# Altium project ADAPTONE_CARTE_DE_SON.PrjPCB (part 1 of 3)
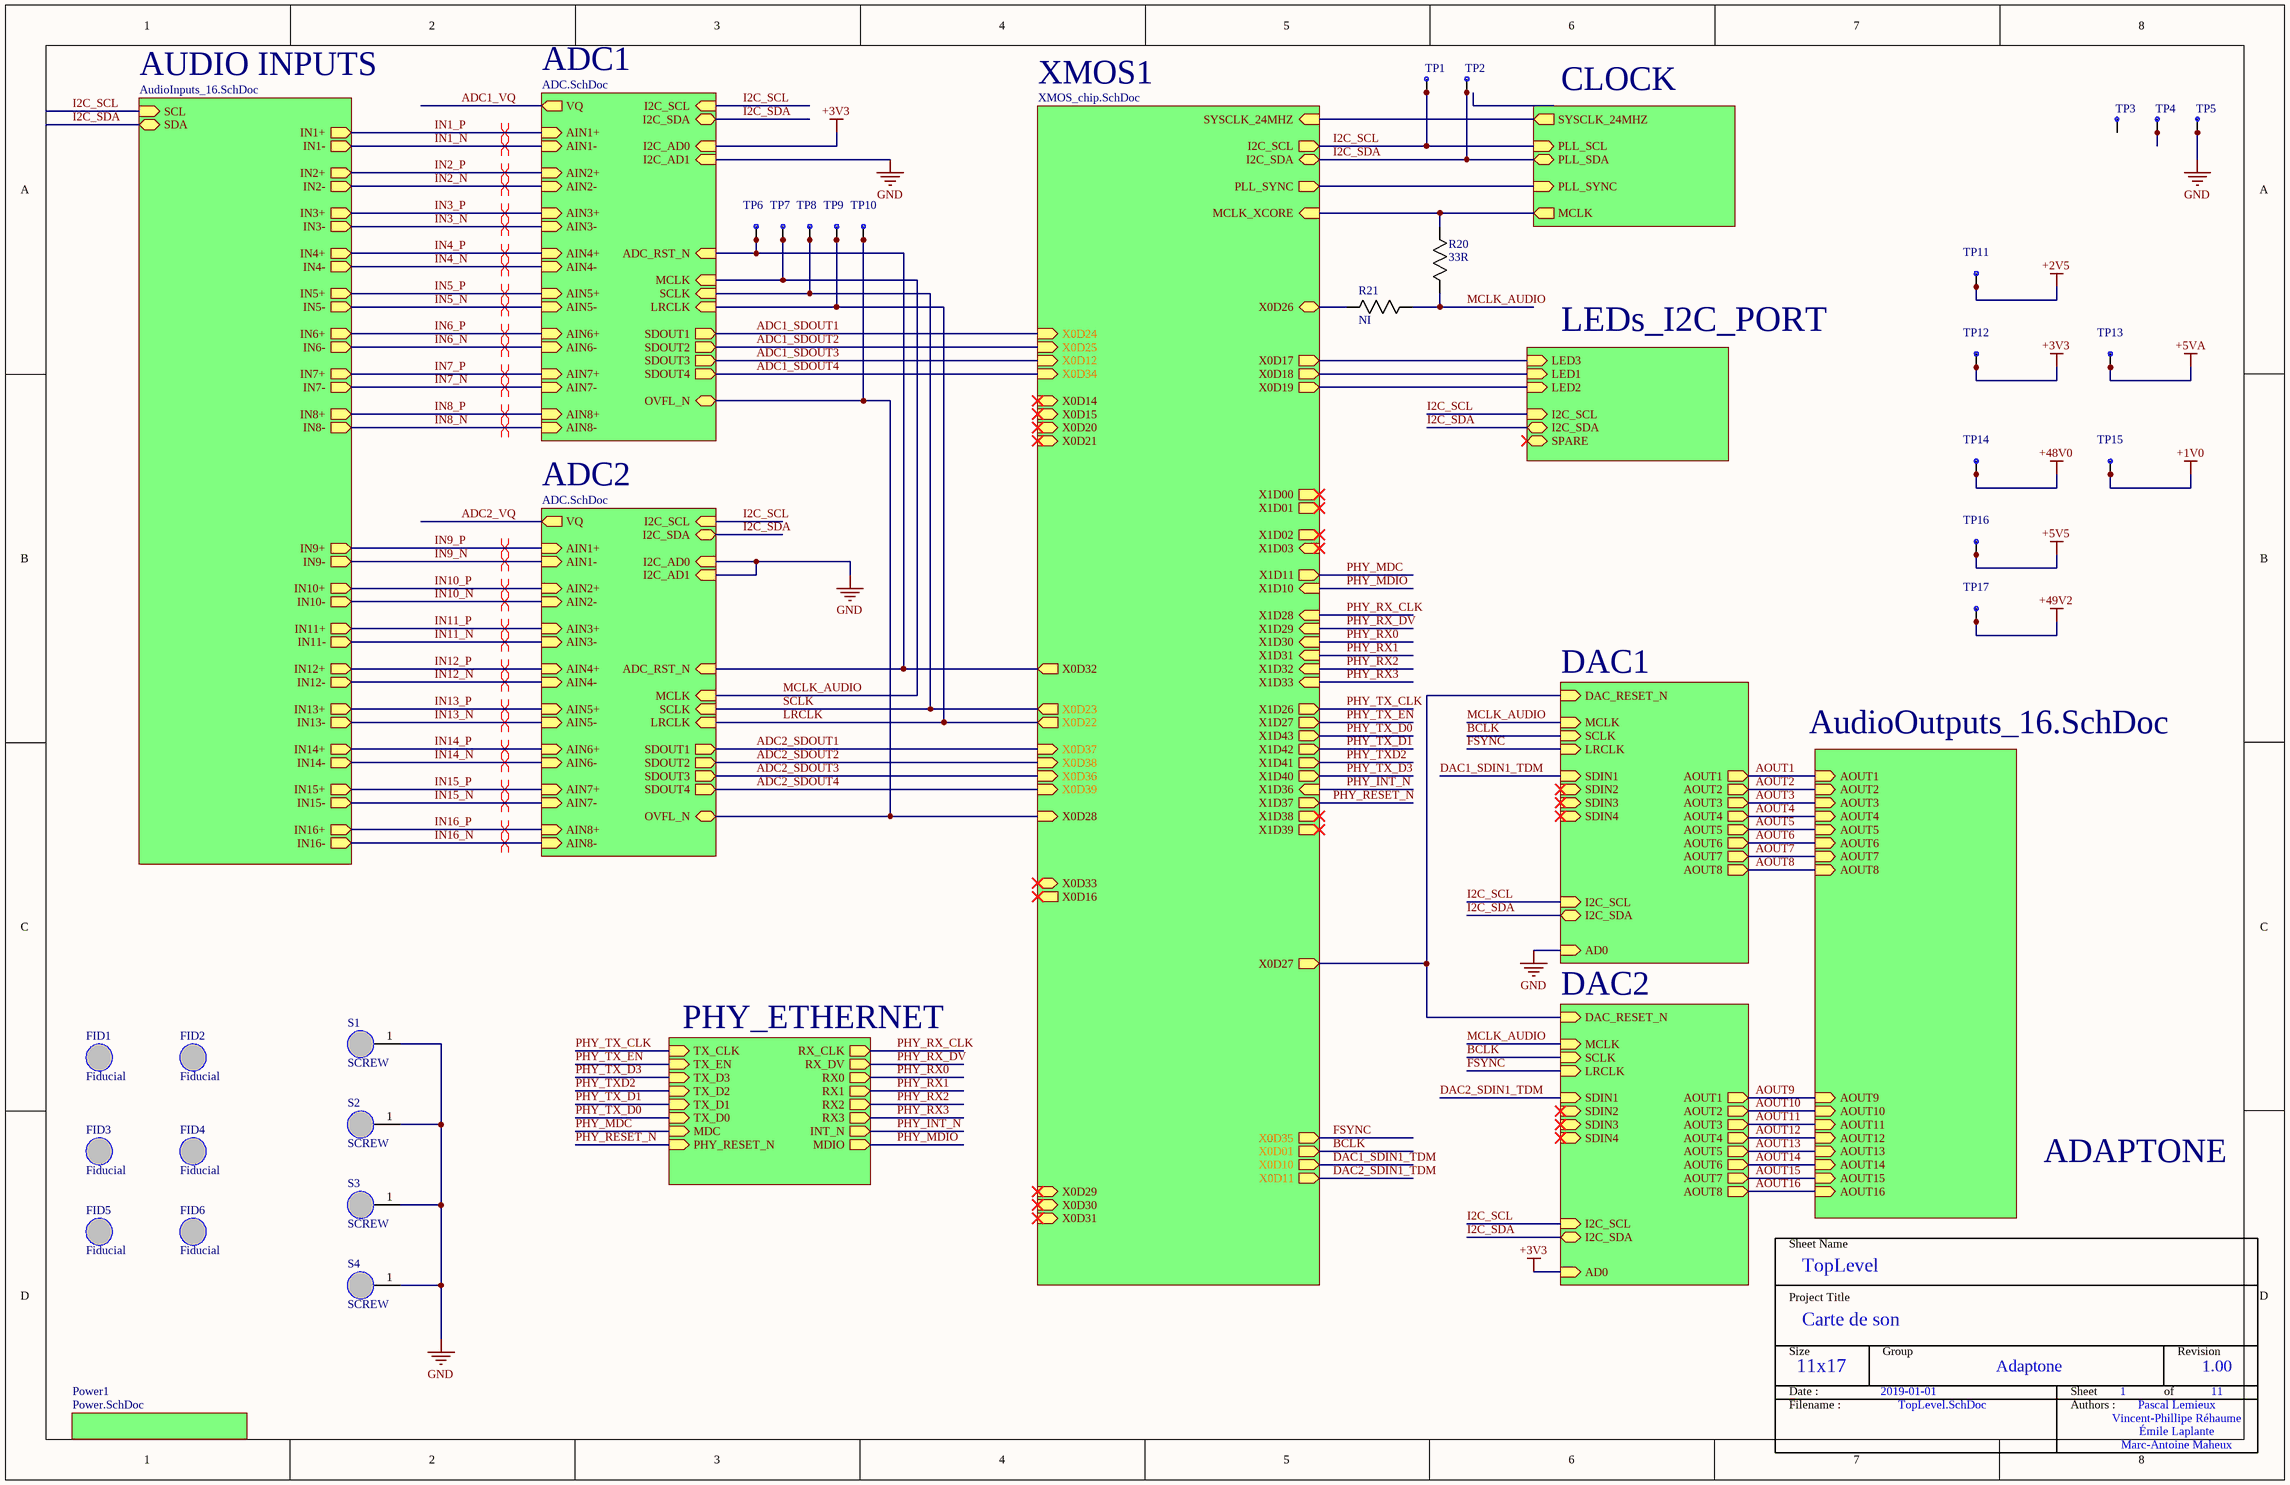
[diagram p0: TopLevel.SchDoc]
Project_Date: 2019-01-01; Project_Designer1: Pascal Lemieux; Project_Designer2: Vincent-Phillipe Réhaume; Project_Designer3: Émile Laplante; Project_Designer4: Marc-Antoine Maheux; Project_Group: Adaptone; Project_Name: Carte de son; Project_Revision: 1.00
15 sheets, 1792 parts. Net scope: hierarchical (ports join the sheet entries above them; power ports are global).
Board file: ADAPTONE_PCB.PcbDoc
Sheets:
  TopLevel.SchDoc
    Power1 = Power.SchDoc
    XMOS1 = XMOS_chip.SchDoc
      XMOS_power = XMOS_power.SchDoc
    CLOCK = Clock.SchDoc
    ADC1 = ADC.SchDoc
    DAC2 = DAC.SchDoc
    AUDIO INPUTS = AudioInputs_16.SchDoc
      U_InputsConnectors = InputsConnectors.SchDoc
        U_InputAmplifier = InputAmplifier.SchDoc
        U_InputAmplifier = InputAmplifier.SchDoc
      U_InputsConnectors = InputsConnectors.SchDoc
        U_InputAmplifier = InputAmplifier.SchDoc
        U_InputAmplifier = InputAmplifier.SchDoc
      U_InputsConnectors = InputsConnectors.SchDoc
        U_InputAmplifier = InputAmplifier.SchDoc
        U_InputAmplifier = InputAmplifier.SchDoc
      U_InputsConnectors = InputsConnectors.SchDoc
        U_InputAmplifier = InputAmplifier.SchDoc
        U_InputAmplifier = InputAmplifier.SchDoc
      U_InputsConnectors = InputsConnectors.SchDoc
        U_InputAmplifier = InputAmplifier.SchDoc
        U_InputAmplifier = InputAmplifier.SchDoc
      U_InputsConnectors = InputsConnectors.SchDoc
        U_InputAmplifier = InputAmplifier.SchDoc
        U_InputAmplifier = InputAmplifier.SchDoc
      U_InputsConnectors = InputsConnectors.SchDoc
        U_InputAmplifier = InputAmplifier.SchDoc
        U_InputAmplifier = InputAmplifier.SchDoc
      U_InputsConnectors = InputsConnectors.SchDoc
        U_InputAmplifier = InputAmplifier.SchDoc
        U_InputAmplifier = InputAmplifier.SchDoc
    DAC1 = DAC.SchDoc
    ADC2 = ADC.SchDoc
    U_AudioOutputs_16 = AudioOutputs_16.SchDoc
      U_OutputConnectors = OutputConnectors.SchDoc
      U_OutputConnectors = OutputConnectors.SchDoc
      U_OutputConnectors = OutputConnectors.SchDoc
      U_OutputConnectors = OutputConnectors.SchDoc
      U_OutputConnectors = OutputConnectors.SchDoc
      U_OutputConnectors = OutputConnectors.SchDoc
      U_OutputConnectors = OutputConnectors.SchDoc
      U_OutputConnectors = OutputConnectors.SchDoc
      U_StereoHeadphoneDriver = StereoHeadphoneDriver.SchDoc
    PHY_ETHERNET = PHY_ETHERNET.SchDoc
    LEDs_I2C_PORT = U_LEDs_I2C_PORT.SchDoc

## Sheet TopLevel.SchDoc
size Tabloid; DocumentNumber: 1; Revision: 1; SheetNumber: 1; SheetTotal: 11; SheetName: Top level; Size: 11x17; Sheet_Name: TopLevel

### Parts
FID1  Fiducial  [FIDUCIAL]
FID2  Fiducial  [FIDUCIAL]
FID3  Fiducial  [FIDUCIAL]
FID4  Fiducial  [FIDUCIAL]
FID5  Fiducial  [FIDUCIAL]
FID6  Fiducial  [FIDUCIAL]
R20  value 33R  [0603]  (hidden comment: Resistor)
R21  Resistor  [0603]  (value not drawn)
S1  SCREW  [SCREW_4_40]
S2  SCREW  [SCREW_4_40]
S3  SCREW  [SCREW_4_40]
S4  SCREW  [SCREW_4_40]
TP1  TESTPOINT  [0603]  (value not drawn)
TP2  TESTPOINT  [0603]  (value not drawn)
TP3  TESTPOINT  [0603]  (value not drawn)
TP4  TESTPOINT  [0603]  (value not drawn)
TP5  TESTPOINT  [0603]  (value not drawn)
TP6  TESTPOINT  [0603]  (value not drawn)
TP7  TESTPOINT  [0603]  (value not drawn)
TP8  TESTPOINT  [0603]  (value not drawn)
TP9  TESTPOINT  [0603]  (value not drawn)
TP10  TESTPOINT  [0603]  (value not drawn)
TP11  TESTPOINT  [0603]  (value not drawn)
TP12  TESTPOINT  [0603]  (value not drawn)
TP13  TESTPOINT  [0603]  (value not drawn)
TP14  TESTPOINT  [0603]  (value not drawn)
TP15  TESTPOINT  [0603]  (value not drawn)
TP16  TESTPOINT  [0603]  (value not drawn)
TP17  TESTPOINT  [0603]  (value not drawn)

### Sub-sheets
ADC1 = ADC.SchDoc: I2C_SCL (in), I2C_SDA (bidir), I2C_AD1 (in), I2C_AD0 (in), SDOUT1 (out), SDOUT2 (out), SDOUT3 (out), SDOUT4 (out), LRCLK (in), SCLK (in), MCLK (in), ADC_RST_N (in), OVFL_N (bidir), AIN1+ (in), AIN1- (in), AIN2+ (in), AIN2- (in), AIN3+ (in), AIN3- (in), AIN4+ (in), AIN4- (in), AIN5+ (in), AIN5- (in), AIN6+ (in), AIN6- (in), AIN7+ (in), AIN7- (in), AIN8+ (in), AIN8- (in), VQ (out)
ADC2 = ADC.SchDoc: I2C_SCL (in), I2C_SDA (bidir), I2C_AD1 (in), I2C_AD0 (in), SDOUT1 (out), SDOUT2 (out), SDOUT3 (out), SDOUT4 (out), LRCLK (in), SCLK (in), MCLK (in), ADC_RST_N (in), OVFL_N (bidir), AIN1+ (in), AIN1- (in), AIN2+ (in), AIN2- (in), AIN3+ (in), AIN3- (in), AIN4+ (in), AIN4- (in), AIN5+ (in), AIN5- (in), AIN6+ (in), AIN6- (in), AIN7+ (in), AIN7- (in), AIN8+ (in), AIN8- (in), VQ (out)
AUDIO INPUTS = AudioInputs_16.SchDoc: IN1+ (out), IN1- (out), IN2+ (out), IN2- (out), IN3+ (out), IN3- (out), IN4+ (out), IN4- (out), IN5+ (out), IN5- (out), IN6+ (out), IN6- (out), IN7+ (out), IN7- (out), IN8+ (out), IN8- (out), SCL (in), SDA (bidir), IN9+ (out), IN9- (out), IN10+ (out), IN10- (out), IN11+ (out), IN11- (out), IN12+ (out), IN12- (out), IN13+ (out), IN13- (out), IN14+ (out), IN14- (out), IN15+ (out), IN15- (out), IN16+ (out), IN16- (out)
CLOCK = Clock.SchDoc: SYSCLK_24MHZ (out), PLL_SYNC (in), PLL_SCL (in), PLL_SDA (bidir), MCLK (out)
DAC1 = DAC.SchDoc: LRCLK (in), SCLK (in), MCLK (in), SDIN1 (in), SDIN2 (in), SDIN3 (in), SDIN4 (in), DAC_RESET_N (in), I2C_SCL (in), I2C_SDA (bidir), AOUT1 (out), AOUT2 (out), AOUT3 (out), AOUT4 (out), AOUT5 (out), AOUT6 (out), AOUT7 (out), AOUT8 (out), AD0 (in)
DAC2 = DAC.SchDoc: LRCLK (in), SCLK (in), MCLK (in), SDIN1 (in), SDIN2 (in), SDIN3 (in), SDIN4 (in), DAC_RESET_N (in), I2C_SCL (in), I2C_SDA (bidir), AOUT1 (out), AOUT2 (out), AOUT3 (out), AOUT4 (out), AOUT5 (out), AOUT6 (out), AOUT7 (out), AOUT8 (out), AD0 (in)
LEDs_I2C_PORT = U_LEDs_I2C_PORT.SchDoc: LED3 (in), LED1 (in), LED2 (in), SPARE (bidir), I2C_SDA (bidir), I2C_SCL (in)
PHY_ETHERNET = PHY_ETHERNET.SchDoc: TX_CLK (in), TX_EN (in), RX_CLK (out), RX_DV (out), RX0 (out), RX1 (out), RX2 (out), RX3 (out), TX_D3 (in), TX_D2 (in), TX_D1 (in), TX_D0 (in), INT_N (out), MDIO (out), MDC (in), PHY_RESET_N (in)
Power1 = Power.SchDoc: no entries
U_AudioOutputs_16 = AudioOutputs_16.SchDoc: AOUT1 (in), AOUT2 (in), AOUT3 (in), AOUT4 (in), AOUT5 (in), AOUT6 (in), AOUT7 (in), AOUT8 (in), AOUT9 (in), AOUT10 (in), AOUT11 (in), AOUT12 (in), AOUT13 (in), AOUT14 (in), AOUT15 (in), AOUT16 (in)
XMOS1 = XMOS_chip.SchDoc: SYSCLK_24MHZ (in), MCLK_XCORE (in), I2C_SCL (out), I2C_SDA (bidir), PLL_SYNC (out), X0D14 (in), X0D15 (in), X0D16 (out), X0D17 (out), X0D18 (out), X0D19 (out), X0D20 (in), X0D21 (in), X0D22 (out), X0D23 (out), X0D24 (in), X0D25 (in), X0D27 (out), X0D32 (out), X0D34 (in), X0D35 (out), X0D36 (in), X0D37 (in), X0D38 (in), X0D39 (in), X0D29 (in), X0D28 (in), X0D31 (in), X0D30 (in), X0D33 (bidir), X0D26 (bidir), X1D26 (out), X1D27 (out), X1D28 (in), X1D29 (in), X1D30 (in), X1D31 (in), X1D32 (in), X1D33 (in), X1D43 (out), X1D42 (out), X1D41 (out), X1D40 (out), X1D10 (in), X1D11 (out), X1D03 (in), X1D02 (out), X1D01 (out), X1D00 (out), X1D37 (out), X1D36 (in), X1D39 (out), X1D38 (out), X0D12 (in), X0D11 (out), X0D01 (out), X0D10 (out)

### Nets
+1V0: TP15.1 TP15.2
+2V5: TP11.1 TP11.2
+3V3: TP12.1 TP12.2 ; sheet ADC1/I2C_AD0, sheet DAC2/AD0
+5V5: TP16.1 TP16.2
+5VA: TP13.1 TP13.2
+48V0: TP14.1 TP14.2
+49V2: TP17.1 TP17.2
GND: S1.1 S2.1 S3.1 S4.1 TP5.1 TP5.2 ; sheet ADC1/I2C_AD1, sheet DAC1/AD0, sheet ADC2/I2C_AD1, sheet ADC2/I2C_AD0
ADC1_SDOUT1: sheet XMOS1/X0D24, sheet ADC1/SDOUT1
ADC1_SDOUT2: sheet XMOS1/X0D25, sheet ADC1/SDOUT2
ADC1_SDOUT3: sheet XMOS1/X0D12, sheet ADC1/SDOUT3
ADC1_SDOUT4: sheet XMOS1/X0D34, sheet ADC1/SDOUT4
ADC2_SDOUT1: sheet XMOS1/X0D37, sheet ADC2/SDOUT1
ADC2_SDOUT2: sheet XMOS1/X0D38, sheet ADC2/SDOUT2
ADC2_SDOUT3: sheet XMOS1/X0D36, sheet ADC2/SDOUT3
ADC2_SDOUT4: sheet XMOS1/X0D39, sheet ADC2/SDOUT4
AOUT1: sheet DAC1/AOUT1, sheet U_AudioOutputs_16/AOUT1
AOUT2: sheet DAC1/AOUT2, sheet U_AudioOutputs_16/AOUT2
AOUT3: sheet DAC1/AOUT3, sheet U_AudioOutputs_16/AOUT3
AOUT4: sheet DAC1/AOUT4, sheet U_AudioOutputs_16/AOUT4
AOUT5: sheet DAC1/AOUT5, sheet U_AudioOutputs_16/AOUT5
AOUT6: sheet DAC1/AOUT6, sheet U_AudioOutputs_16/AOUT6
AOUT7: sheet DAC1/AOUT7, sheet U_AudioOutputs_16/AOUT7
AOUT8: sheet DAC1/AOUT8, sheet U_AudioOutputs_16/AOUT8
AOUT9: sheet DAC2/AOUT1, sheet U_AudioOutputs_16/AOUT9
AOUT10: sheet DAC2/AOUT2, sheet U_AudioOutputs_16/AOUT10
AOUT11: sheet DAC2/AOUT3, sheet U_AudioOutputs_16/AOUT11
AOUT12: sheet DAC2/AOUT4, sheet U_AudioOutputs_16/AOUT12
AOUT13: sheet DAC2/AOUT5, sheet U_AudioOutputs_16/AOUT13
AOUT14: sheet DAC2/AOUT6, sheet U_AudioOutputs_16/AOUT14
AOUT15: sheet DAC2/AOUT7, sheet U_AudioOutputs_16/AOUT15
AOUT16: sheet DAC2/AOUT8, sheet U_AudioOutputs_16/AOUT16
BCLK: sheet XMOS1/X0D01, sheet DAC2/SCLK, sheet DAC1/SCLK
DAC1_SDIN1_TDM: sheet XMOS1/X0D10, sheet DAC1/SDIN1
DAC2_SDIN1_TDM: sheet XMOS1/X0D11, sheet DAC2/SDIN1
FSYNC: sheet XMOS1/X0D35, sheet DAC2/LRCLK, sheet DAC1/LRCLK
I2C_SCL: TP1.1 TP1.2 ; sheet XMOS1/I2C_SCL, sheet CLOCK/PLL_SCL, sheet ADC1/I2C_SCL, sheet DAC2/I2C_SCL, sheet AUDIO INPUTS/SCL, sheet DAC1/I2C_SCL, sheet ADC2/I2C_SCL, sheet LEDs_I2C_PORT/I2C_SCL
I2C_SDA: TP2.1 TP2.2 ; sheet XMOS1/I2C_SDA, sheet CLOCK/PLL_SDA, sheet ADC1/I2C_SDA, sheet DAC2/I2C_SDA, sheet AUDIO INPUTS/SDA, sheet DAC1/I2C_SDA, sheet ADC2/I2C_SDA, sheet LEDs_I2C_PORT/I2C_SDA
IN1_N: sheet ADC1/AIN1-, sheet AUDIO INPUTS/IN1-
IN1_P: sheet ADC1/AIN1+, sheet AUDIO INPUTS/IN1+
IN2_N: sheet ADC1/AIN2-, sheet AUDIO INPUTS/IN2-
IN2_P: sheet ADC1/AIN2+, sheet AUDIO INPUTS/IN2+
IN3_N: sheet ADC1/AIN3-, sheet AUDIO INPUTS/IN3-
IN3_P: sheet ADC1/AIN3+, sheet AUDIO INPUTS/IN3+
IN4_N: sheet ADC1/AIN4-, sheet AUDIO INPUTS/IN4-
IN4_P: sheet ADC1/AIN4+, sheet AUDIO INPUTS/IN4+
IN5_N: sheet ADC1/AIN5-, sheet AUDIO INPUTS/IN5-
IN5_P: sheet ADC1/AIN5+, sheet AUDIO INPUTS/IN5+
IN6_N: sheet ADC1/AIN6-, sheet AUDIO INPUTS/IN6-
IN6_P: sheet ADC1/AIN6+, sheet AUDIO INPUTS/IN6+
IN7_N: sheet ADC1/AIN7-, sheet AUDIO INPUTS/IN7-
IN7_P: sheet ADC1/AIN7+, sheet AUDIO INPUTS/IN7+
IN8_N: sheet ADC1/AIN8-, sheet AUDIO INPUTS/IN8-
IN8_P: sheet ADC1/AIN8+, sheet AUDIO INPUTS/IN8+
IN9_N: sheet AUDIO INPUTS/IN9-, sheet ADC2/AIN1-
IN9_P: sheet AUDIO INPUTS/IN9+, sheet ADC2/AIN1+
IN10_N: sheet AUDIO INPUTS/IN10-, sheet ADC2/AIN2-
IN10_P: sheet AUDIO INPUTS/IN10+, sheet ADC2/AIN2+
IN11_N: sheet AUDIO INPUTS/IN11-, sheet ADC2/AIN3-
IN11_P: sheet AUDIO INPUTS/IN11+, sheet ADC2/AIN3+
IN12_N: sheet AUDIO INPUTS/IN12-, sheet ADC2/AIN4-
IN12_P: sheet AUDIO INPUTS/IN12+, sheet ADC2/AIN4+
IN13_N: sheet AUDIO INPUTS/IN13-, sheet ADC2/AIN5-
IN13_P: sheet AUDIO INPUTS/IN13+, sheet ADC2/AIN5+
IN14_N: sheet AUDIO INPUTS/IN14-, sheet ADC2/AIN6-
IN14_P: sheet AUDIO INPUTS/IN14+, sheet ADC2/AIN6+
IN15_N: sheet AUDIO INPUTS/IN15-, sheet ADC2/AIN7-
IN15_P: sheet AUDIO INPUTS/IN15+, sheet ADC2/AIN7+
IN16_N: sheet AUDIO INPUTS/IN16-, sheet ADC2/AIN8-
IN16_P: sheet AUDIO INPUTS/IN16+, sheet ADC2/AIN8+
LRCLK: TP9.1 TP9.2 ; sheet XMOS1/X0D22, sheet ADC1/LRCLK, sheet ADC2/LRCLK
MCLK_AUDIO: R20.1 R21.2 TP7.1 TP7.2 ; sheet ADC1/MCLK, sheet DAC2/MCLK, sheet DAC1/MCLK, sheet ADC2/MCLK
MCLK_XCORE: R20.2 ; sheet XMOS1/MCLK_XCORE, sheet CLOCK/MCLK
PHY_INT_N: sheet XMOS1/X1D36, sheet PHY_ETHERNET/INT_N  [project net INT_N]
PHY_MDC: sheet XMOS1/X1D11, sheet PHY_ETHERNET/MDC
PHY_MDIO: sheet XMOS1/X1D10, sheet PHY_ETHERNET/MDIO
PHY_RESET_N: sheet XMOS1/X1D37, sheet PHY_ETHERNET/PHY_RESET_N
PHY_RX0: sheet XMOS1/X1D30, sheet PHY_ETHERNET/RX0
PHY_RX1: sheet XMOS1/X1D31, sheet PHY_ETHERNET/RX1
PHY_RX2: sheet XMOS1/X1D32, sheet PHY_ETHERNET/RX2
PHY_RX3: sheet XMOS1/X1D33, sheet PHY_ETHERNET/RX3
PHY_RX_CLK: sheet XMOS1/X1D28, sheet PHY_ETHERNET/RX_CLK
PHY_RX_DV: sheet XMOS1/X1D29, sheet PHY_ETHERNET/RX_DV
PHY_TX_CLK: sheet XMOS1/X1D26, sheet PHY_ETHERNET/TX_CLK
PHY_TX_D0: sheet XMOS1/X1D43, sheet PHY_ETHERNET/TX_D0
PHY_TX_D1: sheet XMOS1/X1D42, sheet PHY_ETHERNET/TX_D1
PHY_TX_D3: sheet XMOS1/X1D40, sheet PHY_ETHERNET/TX_D3
PHY_TX_EN: sheet XMOS1/X1D27, sheet PHY_ETHERNET/TX_EN
PHY_TXD2: sheet XMOS1/X1D41, sheet PHY_ETHERNET/TX_D2
SCLK: TP8.1 TP8.2 ; sheet XMOS1/X0D23, sheet ADC1/SCLK, sheet ADC2/SCLK
NetR1_2: sheet XMOS1/SYSCLK_24MHZ, sheet CLOCK/SYSCLK_24MHZ
NetR21_1: R21.1 ; sheet XMOS1/X0D26
NetR31.1_2: TP10.1 TP10.2 ; sheet XMOS1/X0D28, sheet ADC1/OVFL_N, sheet ADC2/OVFL_N
NetR140_1: sheet XMOS1/X0D18, sheet LEDs_I2C_PORT/LED1
NetR141_1: sheet XMOS1/X0D19, sheet LEDs_I2C_PORT/LED2
NetR142_1: sheet XMOS1/X0D17, sheet LEDs_I2C_PORT/LED3
NetTP3_1: TP3.1 TP3.2
NetTP4_1: TP4.1 TP4.2
NetTP6_1: TP6.1 TP6.2 ; sheet XMOS1/X0D32, sheet ADC1/ADC_RST_N, sheet ADC2/ADC_RST_N
NetU1_5: sheet XMOS1/PLL_SYNC, sheet CLOCK/PLL_SYNC
NetU8_94: sheet XMOS1/X0D27, sheet DAC2/DAC_RESET_N, sheet DAC1/DAC_RESET_N

Not connected (* = marked no-connect by the designer): FID1 0; FID2 0; FID3 0; FID4 0; FID5 0; FID6 0

### Layout directives
differential pair: IN1_N, IN1_P, IN2_N, IN2_P, IN3_N, IN3_P, IN4_N, IN4_P, IN5_N, IN5_P, IN6_N, IN6_P, IN7_N, IN7_P, IN8_N, IN8_P, IN9_N, IN9_P, IN10_N, IN10_P, IN11_N, IN11_P, IN12_N, IN12_P, IN13_N, IN13_P, IN14_N, IN14_P, IN15_N, IN15_P, IN16_N, IN16_P

### Notes on the sheet
- ADAPTONE
- Sheet Name
- Project Title
- Size
- Group
- Revision
- Date :
- Filename :
- Sheet
- Authors :
- of

### Library data of the parts
R20 = Resistor: Mfg: Yageo; Mfg_PN: RC0603JR-0733RL; HelpURL: *; NI: *; Supplier1: Digikey; Supplier1_PN: 311-33GRCT-ND; Type: *; Rating: *; Tolerance: *
R21 = Resistor: Mfg: Yageo; Mfg_PN: RC0603JR-0733RL; Value: 33R; HelpURL: *; NI: NI; Supplier1: Digikey; Supplier1_PN: 311-33GRCT-ND; Type: *; Rating: *; Tolerance: *
S1-S4 = SCREW: Screw hole; HelpURL: *; Mfg: *; Mfg_PN: *; NI: NI; Rating: *; Supplier1: *; Supplier1_PN: *; Tolerance: *; Type: *; Value: *
TP1 TP2 TP6-TP17 = TESTPOINT: Test point; Mfg: TE; Mfg_PN: RCU-0C; HelpURL: *; NI: *; Rating: *; Supplier1: Digikey; Supplier1_PN: A106145CT-ND; Tolerance: *; Type: *; Value: *
TP3-TP5 = TESTPOINT: Test point; Mfg: Harwin; Mfg_PN: S1751-46; HelpURL: *; NI: *; Rating: *; Supplier1: Digikey; Supplier1_PN: 952-3024-ND; Tolerance: *; Type: *; Value: *
FID1-FID6 = Fiducial: HelpURL: *; Mfg: *; Mfg_PN: *; NI: NI; Rating: *; Supplier1: *; Supplier1_PN: *; Tolerance: *; Type: *; Value: *

## Sheet Power.SchDoc
size Tabloid; DocumentNumber: 2; SheetNumber: 2; SheetTotal: 11; SheetName: Main power supply; Size: 11x17; Sheet_Name: Power
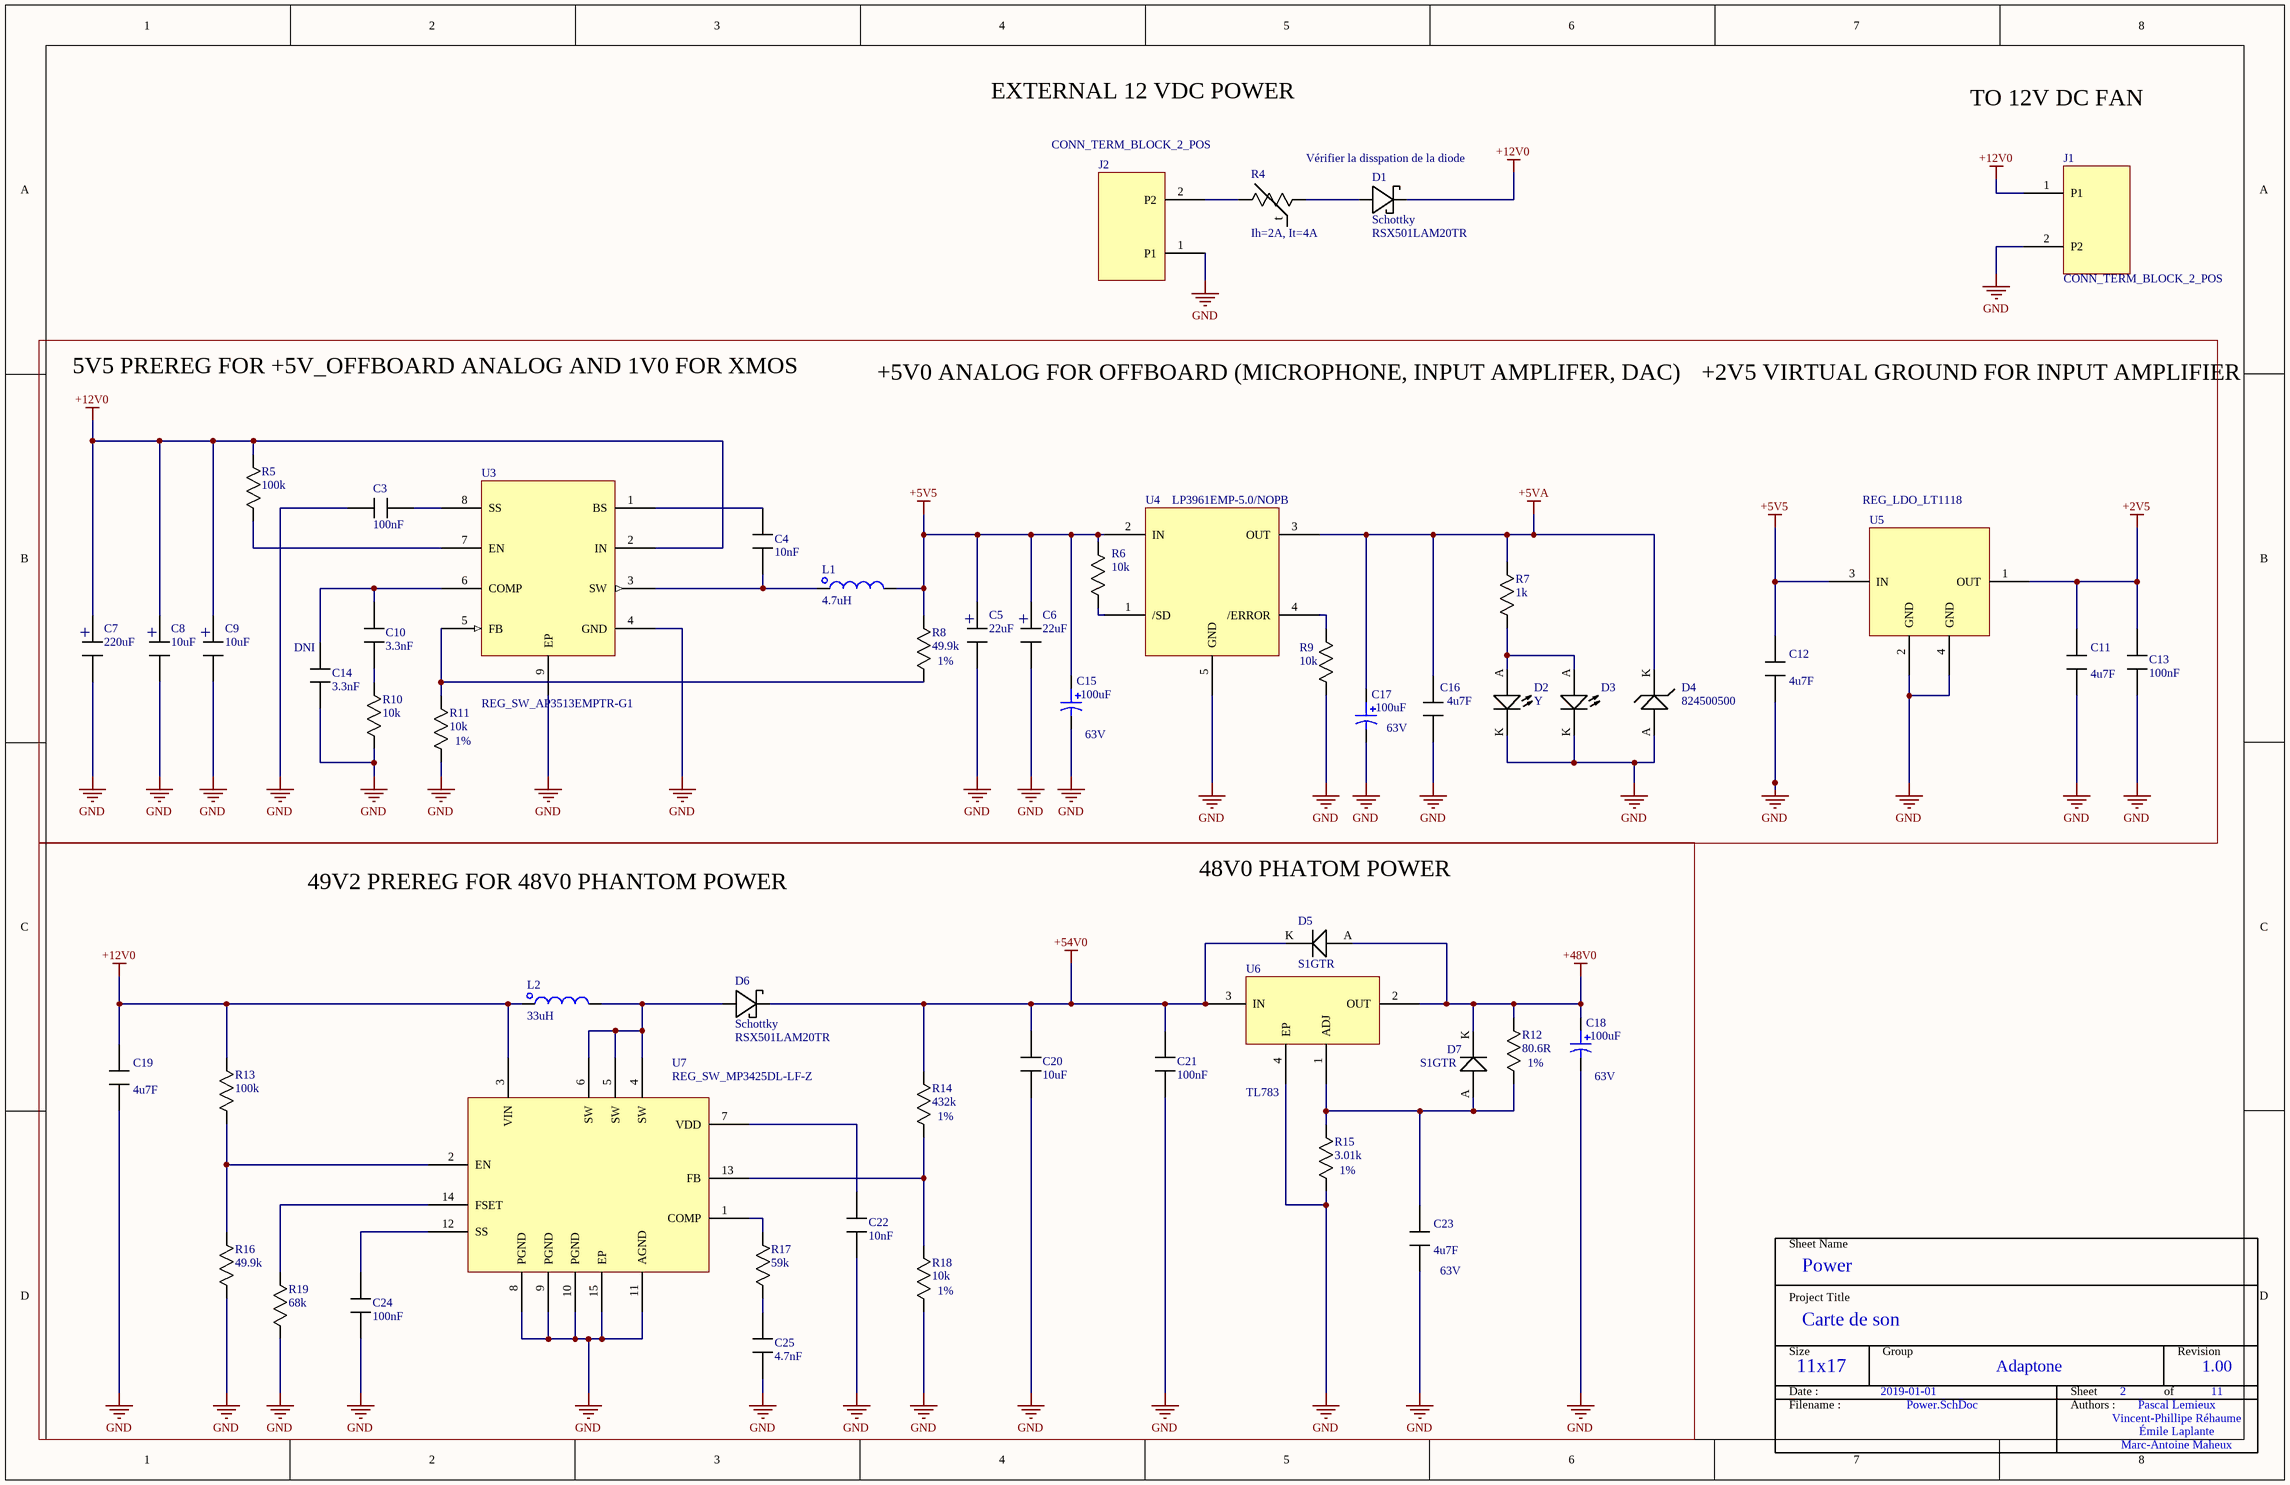
[diagram p1: Power.SchDoc]

### Parts
C3  value 100nF  [0603]  (hidden comment: Capacitor)
C4  value 10nF  [0603]  (hidden comment: Capacitor)
C5  value 22uF  [CAP_RAD_SMD_DIA157]  (hidden comment: Capacitor_Polarized)
C6  value 22uF  [CAP_RAD_SMD_DIA157]  (hidden comment: Capacitor_Polarized)
C7  value 220uF  [CAP_RAD_SMD_DIA315]  (hidden comment: Capacitor_Polarized)
C8  value 10uF  [CAP_RAD_SMD_DIA157]  (hidden comment: Capacitor_Polarized)
C9  value 10uF  [CAP_RAD_SMD_DIA157]  (hidden comment: Capacitor_Polarized)
C10  value 3.3nF  [0603]  (hidden comment: Capacitor)
C11  value 4u7F  [0805]  (hidden comment: Capacitor)
C12  value 4u7F  [0805]  (hidden comment: Capacitor)
C13  value 100nF  [0603]  (hidden comment: Capacitor)
C14  value 3.3nF  note: DNI  [0603]  (hidden comment: Capacitor)
C15  value 100uF  Voltage: 63V  [CAP_ALU_1010_vishay]  (hidden comment: MAL215099101E3)
C16  value 4u7F  [0603]  (hidden comment: Capacitor)
C17  value 100uF  Voltage: 63V  [CAP_ALU_1010_vishay]  (hidden comment: MAL215099101E3)
C18  value 100uF  Voltage: 63V  [CAP_ALU_1010_vishay]  (hidden comment: MAL215099101E3)
C19  value 4u7F  [0805]  (hidden comment: Capacitor)
C20  value 10uF  [CAP_1210]  (hidden comment: Capacitor)
C21  value 100nF  [0603]  (hidden comment: Capacitor)
C22  value 10nF  [0603]  (hidden comment: Capacitor)
C23  value 4u7F  voltage: 63V  [0603]  (hidden comment: Capacitor)
C24  value 100nF  [0603]  (hidden comment: Capacitor)
C25  value 4.7nF  [0603]  (hidden comment: Capacitor)
D1  Schottky  Mfg Part Number: RSX501LAM20TR  [SOD-123F]
D2  Type: Y  [0805_LED]  (hidden comment: Diode_LED)
D3  Diode_LED  [0805_LED]  (value not drawn)
D4  Mfg_PN: 824500500  [DIODE_DO-214AC/SMA]  (hidden comment: Diode_zener)
D5  Mfg_PN: S1GTR  [DIODE_SMA]  (hidden comment: Diode)
D6  Schottky  Mfg Part Number: RSX501LAM20TR  [SOD-123F]
D7  Mfg_PN: S1GTR  [DIODE_SMA]  (hidden comment: Diode)
J1  CONN_TERM_BLOCK_2_POS  [TERM BLOCK]
J2  CONN_TERM_BLOCK_2_POS  [TERM BLOCK]
L1  value 4.7uH  [IND_252012CDMC/DS]  (hidden comment: Inductor)
L2  value 33uH  [IND_252012CDMC/DS]  (hidden comment: Inductor)
R4  value Ih=2A, It=4A  [1206_PTC]  (hidden comment: Resistor_PTC)
R5  value 100k  [0603]  (hidden comment: Resistor)
R6  value 10k  [0603]  (hidden comment: Resistor)
R7  value 1k  [0603]  (hidden comment: Resistor)
R8  value 49.9k  Tolerance: 1%  [0603]  (hidden comment: Resistor)
R9  value 10k  [0603]  (hidden comment: Resistor)
R10  value 10k  [0603]  (hidden comment: Resistor)
R11  value 10k  Tolerance: 1%  [0603]  (hidden comment: Resistor)
R12  value 80.6R  Tolerance: 1%  [0603]  (hidden comment: Resistor)
R13  value 100k  [0603]  (hidden comment: Resistor)
R14  value 432k  Tolerance: 1%  [0603]  (hidden comment: Resistor)
R15  value 3.01k  Tolerance: 1%  [0603]  (hidden comment: Resistor)
R16  value 49.9k  [0603]  (hidden comment: Resistor)
R17  value 59k  [0603]  (hidden comment: Resistor)
R18  value 10k  Tolerance: 1%  [0603]  (hidden comment: Resistor)
R19  value 68k  [0603]  (hidden comment: Resistor)
U3  REG_SW_AP3513EMPTR-G1  [AP3513EMPTR-G1]
U4  LP3961EMP-5.0/NOPB  [TL783]
U5  REG_LDO_LT1118  [SOT-223-3]
U6  TL783  [TL783]
U7  REG_SW_MP3425DL-LF-Z  [14-VFDFN Exposed Pad]

### Nets
+2V5: C11.1 C13.2 U5.1(OUT)
+5V5: C5.+ C6.+ C12.1 C15.1 L1.2 R6.1 R8.1 U4.2(IN) U5.3(IN)
+5VA: C16.1 C17.1 D4.K R7.2 U4.3(OUT)
+12V0: C7.+ C8.+ C9.+ C19.1 D1.2(cathode) J1.1(P1) L2.1 R5.2 R13.2 U3.2(IN) U7.3(VIN)
+48V0: C18.1 D5.A D7.K R12.1 U6.2(OUT)
+54V0: C20.1 C21.2 D5.K D6.2(cathode) R14.1 U6.3(IN)
GND: C3.1 C5.- C6.- C7.- C8.- C9.- C11.2 C12.2 C13.1 C14.2 C15.2 C16.2 C17.2 C18.2 C19.2 C20.2 C21.1 C22.2 C23.2 C24.1 C25.2 D2.K D3.K D4.A J1.2(P2) J2.1(P1) R9.2 R10.2 R11.2 R15.2 R16.2 R18.2 R19.1 U3.4(GND) U3.9(EP) U4.5(GND) U5.2(GND) U5.4(GND) U6.4(EP) U7.8(PGND) U7.9(PGND) U7.10(PGND) U7.11(AGND) U7.15(EP)
NetC3_2: C3.2 U3.8(SS)
NetC4_1: C4.1 U3.1(BS)
NetC4_2: C4.2 L1.1 U3.3(SW)
NetC10_1: C10.1 C14.1 U3.6(COMP)
NetC10_2: C10.2 R10.1
NetC22_1: C22.1 U7.7(VDD)
NetC23_1: C23.1 D7.A R12.2 R15.1 U6.1(ADJ)
NetC24_2: C24.2 U7.12(SS)
NetC25_1: C25.1 R17.2
NetD1_1: D1.1(anode) R4.2
NetD2_A: D2.A D3.A R7.1
NetD6_1: D6.1(anode) L2.2 U7.4(SW) U7.5(SW) U7.6(SW)
NetJ2_2: J2.2(P2) R4.1
NetR5_1: R5.1 U3.7(EN)
NetR6_2: R6.2 U4.1(/SD)
NetR8_2: R8.2 R11.1 U3.5(FB)
NetR9_1: R9.1 U4.4(/ERROR)
NetR13_1: R13.1 R16.1 U7.2(EN)
NetR14_2: R14.2 R18.1 U7.13(FB)
NetR17_1: R17.1 U7.1(COMP)
NetR19_2: R19.2 U7.14(FSET)

### Notes on the sheet
- EXTERNAL 12 VDC POWER
- Vérifier la disspation de la diode
- TO 12V DC FAN
- 5V5 PREREG FOR +5V_OFFBOARD ANALOG AND 1V0 FOR XMOS
- +5V0 ANALOG FOR OFFBOARD (MICROPHONE, INPUT AMPLIFER, DAC)
- +2V5 VIRTUAL GROUND FOR INPUT AMPLIFIER
- 49V2 PREREG FOR 48V0 PHANTOM POWER
- 48V0 PHATOM POWER
- Sheet Name
- Project Title
- Size
- Group
- Revision
- Date :
- Filename :
- Sheet
- Authors :
- of
- (in symbol Resistor_PTC) t

### Library data of the parts
C3 C13 C24 = Capacitor: Mfg: Samsung; Mfg_PN: CL10F104ZO8NNNC; HelpURL: *; NI: NI; Supplier1: Digikey; Supplier1_PN: 1276-1258-1-ND; Tolerance: *; Type: *; Rating: *
C4 C22 = Capacitor: Mfg: Samsung; Mfg_PN: CL10B102KB8NNNC; HelpURL: https://www.digikey.ca/product-detail/en/samsung-electro-mechanics/CL10B102KB8NNNC/1276-1018-1-ND/3889104; NI: NI; Supplier1: Digikey; Supplier1_PN: 1276-1018-1-ND; Tolerance: *; Type: *; Rating: *
C5 = Capacitor_Polarized: Capacitor; Mfg: Panasonic; Mfg_PN: Part Number EEE-FT1V220AR; HelpURL: *; NI: *; Supplier1: Digikey; Supplier1_PN: PCE5012CT-ND; Tolerance: *; Type: *; Rating: *
C6 = Capacitor_Polarized: Capacitor; Mfg: Panasonic; Mfg_PN: EEE-FT1V220AR; HelpURL: *; NI: *; Supplier1: Digikey; Supplier1_PN: PCE5012CT-ND; Tolerance: *; Type: *; Rating: *
C7 = Capacitor_Polarized_1: Capacitor; Mfg: Nichicon; Mfg_PN: UWT1E221MNL1GS; HelpURL: *; NI: *; Supplier1: Digikey; Supplier1_PN: 493-2192-1-ND; Tolerance: *; Type: *; Rating: *
C8 C9 = Capacitor_Polarized: Capacitor; Mfg: Nichicon; Mfg_PN: UWX1C100MCL1GB; HelpURL: *; NI: *; Supplier1: Digikey; Supplier1_PN: 493-2100-1-ND; Tolerance: *; Type: *; Rating: *
C10 C14 = Capacitor: Mfg: Samsung; Mfg_PN: CL10B332JB8NNNC; HelpURL: *; NI: NI; Supplier1: Digikey; Supplier1_PN: 1276-2030-1-ND; Tolerance: *; Type: *; Rating: *
C11 C12 C16 C19 = Capacitor: Mfg: Samsung; Mfg_PN: CL21A475KAQNNNG; HelpURL: *; NI: *; Supplier1: Digikey; Supplier1_PN: 1276-6462-1-ND; Tolerance: *; Type: *; Rating: *
C15 C17 C18 = CAP_ALU_MAL215099101E3: CAP - ALU 100uF 20% 50V - 1010; Mfg Part Number: UUX1J101MNL1GS; Mfg: Nichicon; CreatedBy: Jonathan Bouchard; Temperature: -55°C to 125°C; Power: *; Supplier 1: Digikey; Supplier Part Number 1: 4399PHDKR-ND; Package: 1010; Precision: 20%; Supplier Part Number: *; Supplier Part Number: 493-7453-1-ND
C20 = Capacitor: Mfg: Samsung; Mfg_PN: CL32B106KMVNNWE; HelpURL: https://www.digikey.ca/product-detail/en/samsung-electro-mechanics/CL32B106KMVNNWE/1276-7053-1-ND/7320695; NI: NI; Supplier1: Digikey; Supplier1_PN: 1276-7053-1-ND; Tolerance: *; Type: *; Rating: *
C21 = Capacitor: Mfg: Walsin; Mfg_PN: 0603B104K101CT; HelpURL: *; NI: NI; Supplier1: Digikey; Supplier1_PN: 1292-1392-1-ND; Tolerance: *; Type: *; Rating: *
C23 = Capacitor: Mfg: Samsung; Mfg_PN: CL10A475MQ8NNNC; HelpURL: *; NI: *; Supplier1: Digikey; Supplier1_PN: 1276-1907-1-ND; Tolerance: *; Type: *; Rating: *
C25 = Capacitor: Mfg: Samsung; Mfg_PN: CL10B472KB8NNNC; HelpURL: https://www.digikey.ca/product-detail/en/samsung-electro-mechanics/CL10B472KB8NNNC/1276-1098-1-ND/3889184; NI: NI; Supplier1: Digikey; Supplier1_PN: 1276-1098-1-ND; Tolerance: *; Type: *; Rating: *
D1 = Schottky: Vf = 390mV, Vr = 20V; Current: 5A; Mfg: Rohm Semiconductor; CreatedBy: Emile Laplante; HelpURL: https://www.digikey.ca/product-detail/en/smc-diode-solutions/DSS16UTR/1655-1929-1-ND/8341871; NI: *; Package: *; Power: *; Supplier: Digikey; Supplier Part Numer: RSX501LAM20CT-ND; Temperature: *; Value: *; VerifiedBy: *; Voltage: *
D2 = Diode_LED: LED; Mfg: Osram; Mfg_PN: LY R976-PS-36; HelpURL: *; NI: *; Supplier1: Digikey; Supplier1_PN: 475-2560-1-ND; Tolerance: *; Rating: *; Value: *
D3 = Diode_LED: LED; Mfg: Osram; Mfg_PN: LY R976-PS-36; Type: Y; HelpURL: *; Supplier1: Digikey; Supplier1_PN: 475-2560-1-ND; Tolerance: *; Rating: *; Value: *
D4 = Diode_zener: Diode; Mfg: Wurth; HelpURL: *; NI: *; Supplier1: Digikey; Supplier1_PN: 732-9974-1-ND; Tolerance: *; Type: *; Rating: *; Value: *
D5 D7 = Diode: Mfg: SMC Diode Solutions; HelpURL: *; NI: *; Supplier1: Digikey; Supplier1_PN: 1655-1504-1-ND; Tolerance: *; Type: *; Rating: *; Value: *
D6 = Schottky: Vf = 390mV, Vr = 20V; Mfg: Rohm Semiconductor; CreatedBy: Emile Laplante; HelpURL: https://www.digikey.ca/product-detail/en/smc-diode-solutions/DSS16UTR/1655-1929-1-ND/8341871; NI: *; Package: *; Power: *; Supplier: Digikey; Supplier Part Numer: RSX501LAM20CT-ND; Temperature: *; Value: *; VerifiedBy: *; Voltage: *
L1 = Inductor: Mfg: Bourns Inc.; Mfg_PN: SRN5040-4R7M; HelpURL: *; NI: *; Rating: *; Tolerance: *; Supplier1: Digikey; Supplier1_PN: SRN5040-4R7MCT-ND
L2 = Inductor: Mfg: TDK Corporation; Mfg_PN: VLS5045EX-330M; HelpURL: https://www.digikey.ca/product-detail/en/tdk-corporation/VLS5045EX-330M/445-174851-1-ND/6560408; NI: *; Rating: *; Tolerance: *; Supplier1: Digikey; Supplier1_PN: 445-174851-1-ND
R4 = Resistor_PTC: Mfg: Littelfuse Inc.; Mfg_PN: 1206L150SLYR; NI: *; Supplier1: Digikey; Supplier1_PN: F3367CT-ND; Type: *; Rating: *; Tolerance: *
R5 R13 = Resistor: Mfg: Stackpole Electronics Inc; Mfg_PN: RMCF0603FT100K; HelpURL: https://www.digikey.ca/product-detail/en/stackpole-electronics-inc/RMCF0603FT100K/RMCF0603FT100KCT-ND/1943118; NI: *; Supplier1: Digikey; Supplier1_PN: RMCF0603FT100KCT-ND; Type: *; Rating: *; Tolerance: *
R6 R9 R10 = Resistor: Mfg: Yageo; Mfg_PN: RC0603JR-0710KL; HelpURL: *; NI: *; Supplier1: Digikey; Supplier1_PN: 311-10KGRCT-ND; Type: *; Rating: *; Tolerance: *
R7 = Resistor: Mfg: Yageo; Mfg_PN: RC0603JR-071KL; HelpURL: *; NI: *; Supplier1: Digikey; Supplier1_PN: 311-1.0KGRCT-ND; Type: *; Rating: *; Tolerance: *
R8 R16 = Resistor: Mfg: Yageo; Mfg_PN: RC0603FR-0749K9L; HelpURL: *; NI: *; Supplier1: Digikey; Supplier1_PN: 311-49.9KHRCT-ND; Type: *; Rating: *
  R16: Tolerance: *
R11 R18 = Resistor: Mfg: Stackpole Electronics Inc; Mfg_PN: RNCP0603FTD10K0; HelpURL: *; NI: *; Supplier1: Digikey; Supplier1_PN: RNCP0603FTD10K0CT-ND; Type: *; Rating: *
R12 = Resistor: Mfg: Stackpole Electronics Inc; Mfg_PN: RMCF0603FT80R6; HelpURL: *; NI: *; Supplier1: Digikey; Supplier1_PN: RMCF0603FT80R6CT-ND; Type: *; Rating: *
R14 = Resistor: Mfg: Yageo; Mfg_PN: RC0603FR-07432KL; HelpURL: *; NI: *; Supplier1: Digikey; Supplier1_PN: 311-432KHRCT-ND; Type: *; Rating: *
R15 = Resistor: Mfg: Panasonic Electronic Components; Mfg_PN: ERJ-3EKF3011V; HelpURL: *; NI: *; Supplier1: Digikey; Supplier1_PN: P3.01KHCT-ND; Type: *; Rating: *
R17 = Resistor: Mfg: Stackpole Electronics Inc; Mfg_PN: RMCF0603FT59K0; HelpURL: https://www.digikey.ca/product-detail/en/stackpole-electronics-inc/RMCF0603FT59K0/RMCF0603FT59K0CT-ND/4425114; NI: *; Supplier1: Digikey; Supplier1_PN: RMCF0603FT59K0CT-ND; Type: *; Rating: *; Tolerance: *
R19 = Resistor: Mfg: Yageo; Mfg_PN: RC0603FR-0768KL; HelpURL: https://www.digikey.ca/product-detail/en/yageo/RC0603FR-0768KL/311-68.0KHRCT-ND/730299; NI: *; Supplier1: Digikey; Supplier1_PN: 311-68.0KHRCT-ND; Type: *; Rating: *; Tolerance: *
U3 = REG_SW_AP3513EMPTR-G1: Mfg: Diodes Incorporated; CreatedBy: Emile Laplante; HelpURL: https://www.digikey.ca/product-detail/en/diodes-incorporated/AP3513EMPTR-G1/AP3513EMPTR-G1DICT-ND/4505181; Mfg Part Number: AP3513EMPTR-G1; NI: *; Power: *; Supplier: Digikey; Supplier Part Numer: AP3513EMPTR-G1DICT-ND; Temperature: *; Value: *; VerifiedBy: *; Voltage: *
U4 = LP3961EMP-5.0/NOPB: Mfg: Texas Instruments; CreatedBy: Emile Laplante; HelpURL: https://www.digikey.ca/product-detail/en/texas-instruments/LP3961EMP-5.0-NOPB/LP3961EMP-5.0-NOPBCT-ND/364674; Mfg Part Number: LP3961EMP-5.0/NOPB; NI: *; Package: *; Power: *; Supplier: Digikey; Supplier Part Numer: LP3961EMP-5.0/NOPBCT-ND; Temperature: *; Value: *; VerifiedBy: *; Voltage: *
U5 = REG_LDO_LT1118: Mfg Part Number: LT1118CST-2.5#PBF; Mfg: Linear Technology/Analog Devices; CreatedBy: Emile Laplante; HelpURL: https://www.digikey.ca/products/en?keywords=LT1118CST-2.5%23PBF; NI: *; Package: SOT-223-3; Power: *; Supplier: Digikey; Supplier Part Numer: LT1118CST-2.5#PBF-ND; Temperature: *; Value: *; VerifiedBy: *; Voltage: *
U6 = TL783: Mfg Part Number: TL783CKTTR; Mfg: Texas Instruments; CreatedBy: Emile Laplante; HelpURL: https://www.digikey.ca/product-detail/en/texas-instruments/TL783CKTTR/296-20778-1-ND/1204637; NI: *; Package: *; Power: *; Supplier: Digikey; Supplier Part Numer: 296-20778-1-ND; Temperature: *; Value: *; VerifiedBy: *; Voltage: *
U7 = REG_SW_MP3425DL-LF-Z: Mfg: Monolithic Power Systems Inc.; CreatedBy: Emile Laplante; HelpURL: https://www.digikey.ca/product-detail/en/monolithic-power-systems-inc/MP3425DL-LF-Z/1589-1643-1-ND/9433409; Mfg Part Number: MP3425DL-LF-Z; NI: *; Power: *; Supplier: Digikey; Supplier Part Numer: 1589-1643-1-ND; Temperature: *; Value: *; VerifiedBy: *; Voltage: *

## Sheet XMOS_chip.SchDoc
size Tabloid; DocumentNumber: 5; SheetNumber: 5; SheetTotal: 11; SheetName: XMOS processor; Size: 11x17; Sheet_Name: XMOS_chip
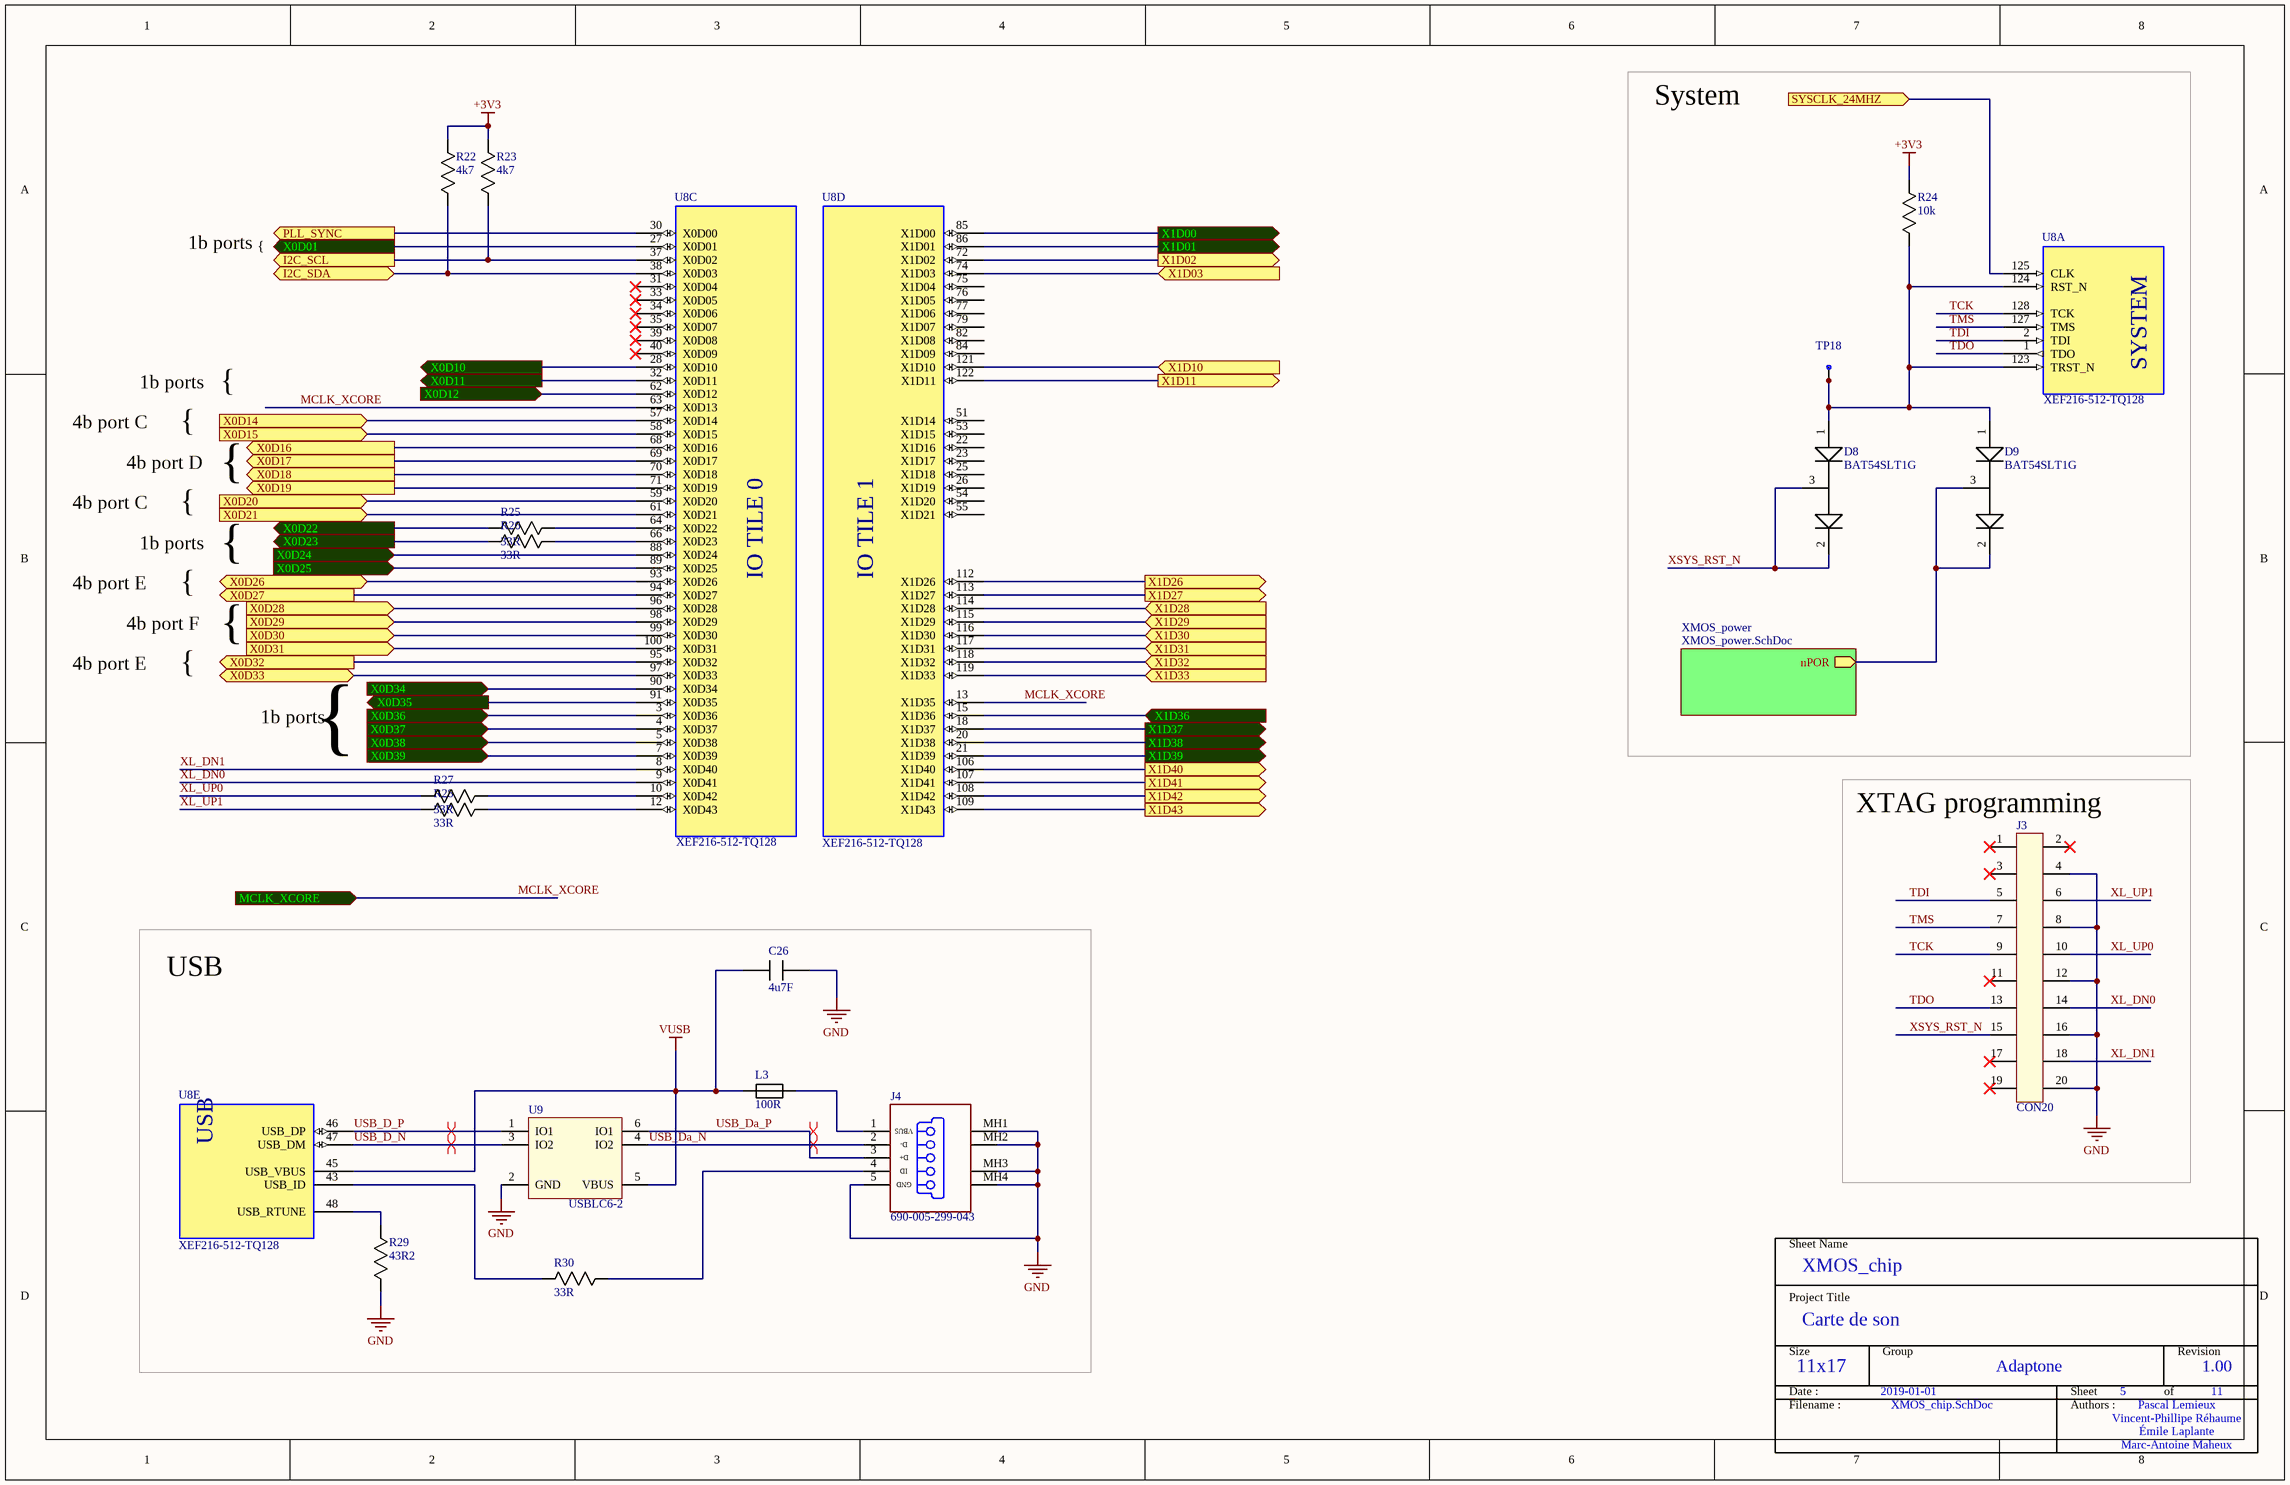
[diagram p2: XMOS_chip.SchDoc]

### Parts
C26  value 4u7F  [0603]  (hidden comment: Capacitor)
D8  Mfg_PN: BAT54SLT1G  [SOT23_132]  (hidden comment: Diode_dual)
D9  Mfg_PN: BAT54SLT1G  [SOT23_132]  (hidden comment: Diode_dual)
J3  CON20  [CONN20_100mils_pol_SMD]
J4  Mfg_PN: 690-005-299-043  [CONN_USB_MINIB_690-005-299-043]  (hidden comment: USB_MINIB_690-005-299-043)
L3  value 100R  [0805]  (hidden comment: Ferrite)
R22  value 4k7  [0603]  (hidden comment: Resistor)
R23  value 4k7  [0603]  (hidden comment: Resistor)
R24  value 10k  [0603]  (hidden comment: Resistor)
R25  value 33R  [0603]  (hidden comment: Resistor)
R26  value 33R  [0603]  (hidden comment: Resistor)
R27  value 33R  [0603]  (hidden comment: Resistor)
R28  value 33R  [0603]  (hidden comment: Resistor)
R29  value 43R2  [0603]  (hidden comment: Resistor)
R30  value 33R  [0603]  (hidden comment: Resistor)
TP18  TESTPOINT  [0603]  (value not drawn)
U8  Mfg_PN: XEF216-512-TQ128  [TQFP128_XMOS]  (parts A,C,D,E of 5)
U9  USBLC6-2  [USBLC6-2]

### Blocks framed on the sheet
System: D8 D9 R24 TP18 U8
XTAG programming: J3
USB: C26 J4 L3 R29 R30 U8 U9

### Sub-sheets
XMOS_power = XMOS_power.SchDoc: nPOR (out)

### Ports
I2C_SCL (out), I2C_SDA (bidir), MCLK_XCORE (in), PLL_SYNC (out), SYSCLK_24MHZ (in), X0D01 (out), X0D10 (out), X0D11 (out), X0D12 (in), X0D14 (in), X0D15 (in), X0D16 (out), X0D17 (out), X0D18 (out), X0D19 (out), X0D20 (in), X0D21 (in), X0D22 (out), X0D23 (out), X0D24 (in), X0D25 (in), X0D26 (bidir), X0D27 (out), X0D28 (in), X0D29 (in), X0D30 (in), X0D31 (in), X0D32 (out), X0D33 (bidir), X0D34 (in), X0D35 (out), X0D36 (in), X0D37 (in), X0D38 (in), X0D39 (in), X1D00 (out), X1D01 (out), X1D02 (out), X1D03 (in), X1D10 (in), X1D11 (out), X1D26 (out), X1D27 (out), X1D28 (in), X1D29 (in), X1D30 (in), X1D31 (in), X1D32 (in), X1D33 (in), X1D36 (in), X1D37 (out), X1D38 (out), X1D39 (out), X1D40 (out), X1D41 (out), X1D42 (out), X1D43 (out)

### Nets
+3V3: R22.1 R23.1 R24.1
GND: C26.2 J3.4 J3.8 J3.12 J3.16 J3.20 J4.5(GND) J4.MH1(Tab) J4.MH2(Tab) J4.MH3(Tab) J4.MH4(Tab) R29.1 U9.2(GND)
VUSB: C26.1 L3.1 U8.45(USB_VBUS) U9.5(VBUS)
ADC1_SDOUT1: U8.88(X0D24) ; port X0D24
ADC1_SDOUT2: U8.89(X0D25) ; port X0D25
ADC1_SDOUT3: U8.62(X0D12) ; port X0D12
ADC1_SDOUT4: U8.90(X0D34) ; port X0D34
ADC2_SDOUT1: U8.4(X0D37) ; port X0D37
ADC2_SDOUT2: U8.5(X0D38) ; port X0D38
ADC2_SDOUT3: U8.3(X0D36) ; port X0D36
ADC2_SDOUT4: U8.7(X0D39) ; port X0D39
BCLK: U8.27(X0D01) ; port X0D01
DAC1_SDIN1_TDM: U8.28(X0D10) ; port X0D10
DAC2_SDIN1_TDM: U8.32(X0D11) ; port X0D11
FSYNC: U8.91(X0D35) ; port X0D35
I2C_SCL: R23.2 U8.37(X0D02) ; port I2C_SCL
I2C_SDA: R22.2 U8.38(X0D03) ; port I2C_SDA
INT_N: U8.15(X1D36) ; port X1D36
LRCLK: R25.1 ; port X0D22
MCLK_XCORE: U8.13(X1D35) U8.63(X0D13) ; port MCLK_XCORE
PHY_MDC: U8.122(X1D11) ; port X1D11
PHY_MDIO: U8.121(X1D10) ; port X1D10
PHY_RESET_N: U8.18(X1D37) ; port X1D37
PHY_RX0: U8.116(X1D30) ; port X1D30
PHY_RX1: U8.117(X1D31) ; port X1D31
PHY_RX2: U8.118(X1D32) ; port X1D32
PHY_RX3: U8.119(X1D33) ; port X1D33
PHY_RX_CLK: U8.114(X1D28) ; port X1D28
PHY_RX_DV: U8.115(X1D29) ; port X1D29
PHY_TX_CLK: U8.112(X1D26) ; port X1D26
PHY_TX_D0: U8.109(X1D43) ; port X1D43
PHY_TX_D1: U8.108(X1D42) ; port X1D42
PHY_TX_D3: U8.106(X1D40) ; port X1D40
PHY_TX_EN: U8.113(X1D27) ; port X1D27
PHY_TXD2: U8.107(X1D41) ; port X1D41
SCLK: R26.1 ; port X0D23
TCK: J3.9 U8.128(TCK)
TDI: J3.5 U8.2(TDI)
TDO: J3.13 U8.1(TDO)
TMS: J3.7 U8.127(TMS)
USB_D_N: U8.47(USB_DM) U9.3(IO2)
USB_D_P: U8.46(USB_DP) U9.1(IO1)
USB_Da_N: J4.2(D-) U9.4(IO2)
USB_Da_P: J4.3(D+) U9.6(IO1)
XL_DN0: J3.14 U8.9(X0D41)
XL_DN1: J3.18 U8.8(X0D40)
XL_UP0: J3.10 R27.1
XL_UP1: J3.6 R28.1
XSYS_RST_N: D8.2(K) D8.3(AK) J3.15
NetD8_1: D8.1(K) D9.1(K) R24.2 TP18.1 TP18.2 U8.123(TRST_N) U8.124(RST_N)
NetD9_2: D9.2(K) D9.3(AK) ; sheet XMOS_power/nPOR
NetJ4_1: J4.1(V_BUS_(5V)) L3.2
NetJ4_4: J4.4(NC) R30.1
NetR1_2: U8.125(CLK) ; port SYSCLK_24MHZ
NetR21_1: U8.93(X0D26) ; port X0D26
NetR25_2: R25.2 U8.64(X0D22)
NetR26_2: R26.2 U8.66(X0D23)
NetR27_2: R27.2 U8.10(X0D42)
NetR28_2: R28.2 U8.12(X0D43)
NetR29_2: R29.2 U8.48(USB_RTUNE)
NetR30_2: R30.2 U8.43(USB_ID)
NetR31.1_2: U8.96(X0D28) ; port X0D28
NetR140_1: U8.70(X0D18) ; port X0D18
NetR141_1: U8.71(X0D19) ; port X0D19
NetR142_1: U8.69(X0D17) ; port X0D17
NetTP6_1: U8.95(X0D32) ; port X0D32
NetU1_5: U8.30(X0D00) ; port PLL_SYNC
NetU8_20: U8.20(X1D38) ; port X1D38
NetU8_21: U8.21(X1D39) ; port X1D39
NetU8_57: U8.57(X0D14) ; port X0D14
NetU8_58: U8.58(X0D15) ; port X0D15
NetU8_59: U8.59(X0D20) ; port X0D20
NetU8_61: U8.61(X0D21) ; port X0D21
NetU8_68: U8.68(X0D16) ; port X0D16
NetU8_72: U8.72(X1D02) ; port X1D02
NetU8_74: U8.74(X1D03) ; port X1D03
NetU8_85: U8.85(X1D00) ; port X1D00
NetU8_86: U8.86(X1D01) ; port X1D01
NetU8_94: U8.94(X0D27) ; port X0D27
NetU8_97: U8.97(X0D33) ; port X0D33
NetU8_98: U8.98(X0D29) ; port X0D29
NetU8_99: U8.99(X0D30) ; port X0D30
NetU8_100: U8.100(X0D31) ; port X0D31

Not connected (* = marked no-connect by the designer): J3 1* 2* 3* 11* 17* 19*; U8 22(X1D16) 23(X1D17) 25(X1D18) 26(X1D19) 31(X0D04)* 33(X0D05)* 34(X0D06)* 35(X0D07)* 39(X0D08)* 40(X0D09)* 51(X1D14) 53(X1D15) 54(X1D20) 55(X1D21) 75(X1D04) 76(X1D05) 77(X1D06) 79(X1D07) 82(X1D08) 84(X1D09)

### Layout directives
differential pair: USB_D_N, USB_D_P, USB_Da_N, USB_Da_P

### Notes on the sheet
- 1b ports
- {
- 4b port C
- 4b port D
- 4b port E
- 4b port F
- Sheet Name
- Project Title
- Size
- Group
- Revision
- Date :
- Filename :
- Sheet
- Authors :
- of
- (in symbol USB_MINIB_690-005-299-043) VBUS; ID
- (in symbol XMOS_XEF216-512-TQ128, part A) SYSTEM
- (in symbol XMOS_XEF216-512-TQ128, part C) IO TILE 0
- (in symbol XMOS_XEF216-512-TQ128, part D) IO TILE 1
- (in symbol XMOS_XEF216-512-TQ128, part E) USB

### Library data of the parts
C26 = Capacitor: Mfg: Samsung; Mfg_PN: CL21A475KAQNNNG; HelpURL: *; NI: *; Supplier1: Digikey; Supplier1_PN: 1276-6462-1-ND; Tolerance: *; Type: *; Rating: *
D8 D9 = Diode_dual: Diode; Mfg: Onsemi; HelpURL: *; NI: *; Supplier1: Digikey; Supplier1_PN: BAT54SLT1GOSCT-ND; Tolerance: *; Type: *; Rating: *; Value: *
J3 = CON20: 20-pins; Mfg: CNC Tech; Mfg_PN: 3020-20-0300-00; HelpURL: *; NI: *; Rating: *; Supplier1: Digikey; Supplier1_PN: 1175-1623-ND; Tolerance: *; Type: *; Value: *
J4 = USB_MINIB_690-005-299-043: USB On-The-Go (OTG) Mini-B Receptacle, Right Angle, SMT, 0.80mm (.031") Pitch, Solder Tabs with Back Cover, Recessed Type; Mfg: EDAC; Supplier1: Digikey; Supplier1_PN: 151-1206-1-ND
L3 = Ferrite: Mfg: Bourns; Mfg_PN: MH2029-101Y; Rating: 1A; HelpURL: *; NI: *; Supplier1: Digikey; Supplier1_PN: MH2029-101YCT-ND; Tolerance: *; Type: *
R22 R23 = Resistor: Mfg: Yageo; Mfg_PN: RC0603JR-074K7L; HelpURL: *; NI: *; Supplier1: Digikey; Supplier1_PN: 311-4.7KGRCT-ND; Type: *; Rating: *; Tolerance: *
R24 = Resistor: Mfg: Yageo; Mfg_PN: RC0603JR-0710KL; HelpURL: *; NI: *; Supplier1: Digikey; Supplier1_PN: 311-10KGRCT-ND; Type: *; Rating: *; Tolerance: *
R25-R28 R30 = Resistor: Mfg: Yageo; Mfg_PN: RC0603JR-0733RL; HelpURL: *; NI: *; Supplier1: Digikey; Supplier1_PN: 311-33GRCT-ND; Type: *; Rating: *; Tolerance: *
R29 = Resistor: Mfg: Yageo; Mfg_PN: RC0603FR-0743R2L; HelpURL: *; NI: *; Supplier1: Digikey; Supplier1_PN: 311-43.2HRCT-ND; Type: *; Rating: *; Tolerance: *
TP18 = TESTPOINT: Test point; Mfg: TE; Mfg_PN: RCU-0C; HelpURL: *; NI: *; Rating: *; Supplier1: Digikey; Supplier1_PN: A106145CT-ND; Tolerance: *; Type: *; Value: *
U8 = XMOS_XEF216-512-TQ128: 32-bit multicore microcontroller. 2 Tiles. 16 Logical Cores. 512KB SRAM. 1000MIPS. TQFP128.; Mfg: XMOS; Supplier1: Digikey; Supplier1_PN: 880-1100-ND
U9 = USBLC6-2: USB overvoltage protection; Mfg: ST; HelpURL: http://www.st.com/web/en/resource/technical/document/datasheet/CD00050750.pdf; Mfg_PN: USBLC6-2; NI: *; Supplier1: Digikey; Supplier1_PN: 497-5026-2-ND; Type: *

## Sheet XMOS_power.SchDoc
size Tabloid; DocumentNumber: 3; SheetNumber: 3; SheetTotal: 11; SheetName: XMOS power supply; Size: 11x17; Sheet_Name: XMOS power supply
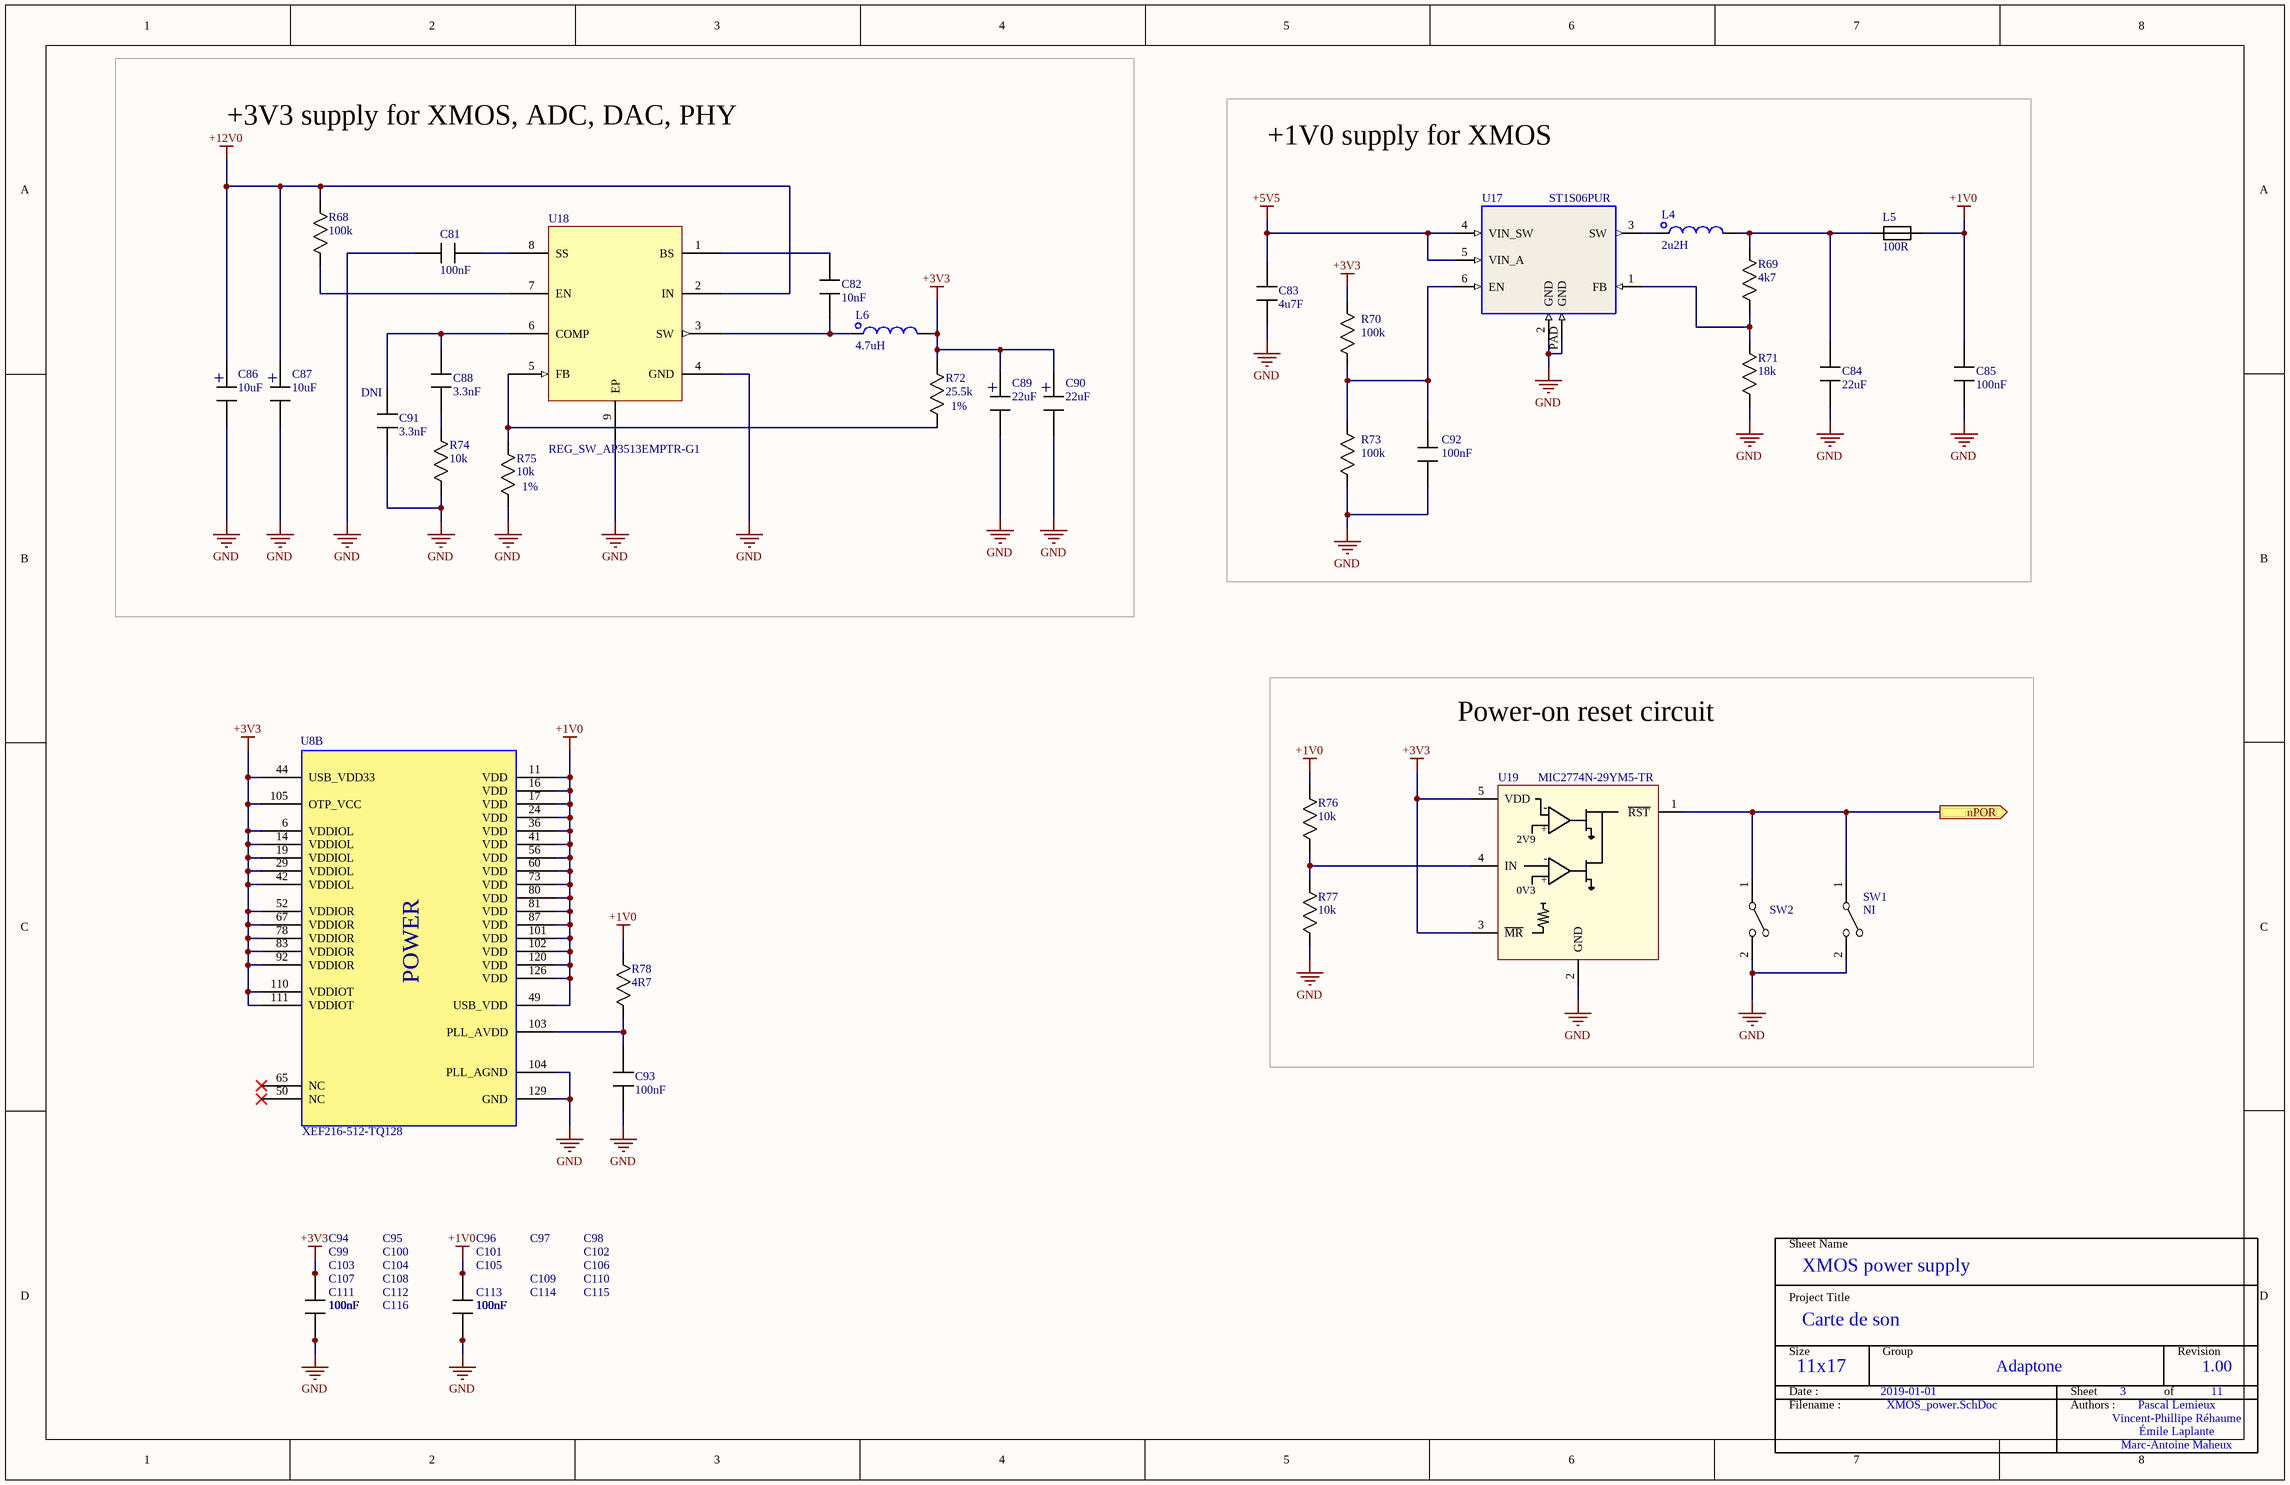
[diagram p3: XMOS_power.SchDoc]

### Parts
C81  value 100nF  [0603]  (hidden comment: Capacitor)
C82  value 10nF  [0603]  (hidden comment: Capacitor)
C83  value 4u7F  [0805]  (hidden comment: Capacitor)
C84  value 22uF  [1206]  (hidden comment: Capacitor)
C85  value 100nF  [0603]  (hidden comment: Capacitor)
C86  value 10uF  [CAP_RAD_SMD_DIA157]  (hidden comment: Capacitor_Polarized)
C87  value 10uF  [CAP_RAD_SMD_DIA157]  (hidden comment: Capacitor_Polarized)
C88  value 3.3nF  [0603]  (hidden comment: Capacitor)
C89  value 22uF  [CAP_RAD_SMD_DIA157]  (hidden comment: Capacitor_Polarized)
C90  value 22uF  [CAP_RAD_SMD_DIA157]  (hidden comment: Capacitor_Polarized)
C91  value 3.3nF  note: DNI  [0603]  (hidden comment: Capacitor)
C92  value 100nF  [0603]  (hidden comment: Capacitor)
C93  value 100nF  [0603]  (hidden comment: Capacitor)
C94  value 100nF  [0603]  (hidden comment: Capacitor)
C95  value 100nF  [0603]  (hidden comment: Capacitor)
C96  value 100nF  [0603]  (hidden comment: Capacitor)
C97  value 100nF  [0603]  (hidden comment: Capacitor)
C98  value 100nF  [0603]  (hidden comment: Capacitor)
C99  value 100nF  [0603]  (hidden comment: Capacitor)
C100  value 100nF  [0603]  (hidden comment: Capacitor)
C101  value 100nF  [0603]  (hidden comment: Capacitor)
C102  value 100nF  [0603]  (hidden comment: Capacitor)
C103  value 100nF  [0603]  (hidden comment: Capacitor)
C104  value 100nF  [0603]  (hidden comment: Capacitor)
C105  value 100nF  [0603]  (hidden comment: Capacitor)
C106  value 100nF  [0603]  (hidden comment: Capacitor)
C107  value 100nF  [0603]  (hidden comment: Capacitor)
C108  value 100nF  [0603]  (hidden comment: Capacitor)
C109  value 100nF  [0603]  (hidden comment: Capacitor)
C110  value 100nF  [0603]  (hidden comment: Capacitor)
C111  value 100nF  [0603]  (hidden comment: Capacitor)
C112  value 100nF  [0603]  (hidden comment: Capacitor)
C113  value 100nF  [0603]  (hidden comment: Capacitor)
C114  value 100nF  [0603]  (hidden comment: Capacitor)
C115  value 100nF  [0603]  (hidden comment: Capacitor)
C116  value 100nF  [0603]  (hidden comment: Capacitor)
L4  value 2u2H  [IND_252012CDMC/DS]  (hidden comment: Inductor)
L5  value 100R  [0805]  (hidden comment: Ferrite)
L6  value 4.7uH  [SRN5040-4R7M]  (hidden comment: Inductor)
R68  value 100k  [0603]  (hidden comment: Resistor)
R69  value 4k7  [0603]  (hidden comment: Resistor)
R70  value 100k  [0603]  (hidden comment: Resistor)
R71  value 18k  [0603]  (hidden comment: Resistor)
R72  value 25.5k  Tolerance: 1%  [0603]  (hidden comment: Resistor)
R73  value 100k  [0603]  (hidden comment: Resistor)
R74  value 10k  [0603]  (hidden comment: Resistor)
R75  value 10k  Tolerance: 1%  [0603]  (hidden comment: Resistor)
R76  value 10k  [0603]  (hidden comment: Resistor)
R77  value 10k  [0603]  (hidden comment: Resistor)
R78  value 4R7  [0603]  (hidden comment: Resistor)
SW1  Button  [BUTTON_WS-TASV]  (value not drawn)
SW2  Button  [BUTTON_WS-TASV]  (value not drawn)
U8  Mfg_PN: XEF216-512-TQ128  [TQFP128_XMOS]  (part B of 5)
U17  ST1S06PUR  [DFN6_ST1S06]
U18  REG_SW_AP3513EMPTR-G1  [AP3513EMPTR-G1]
U19  MIC2774N-29YM5-TR  [SOT23_5]

### Blocks framed on the sheet
+3V3 supply for XMOS, ADC, DAC, PHY: C81 C82 C86-C91 L6 R68 R72 R74 R75 U18
+1V0 supply for XMOS: C83-C85 C92 L4 L5 R69-R71 R73 U17
Power-on reset circuit: R76 R77 SW1 SW2 U19

### Ports
nPOR (out)

### Nets
+1V0: C85.1 C96.1 C97.1 C98.1 C101.1 C102.1 C105.1 C106.1 C109.1 C110.1 C113.1 C114.1 C115.1 L5.2 R76.1 R78.1 U8.11(VDD) U8.16(VDD) U8.17(VDD) U8.24(VDD) U8.36(VDD) U8.41(VDD) U8.49(USB_VDD) U8.56(VDD) U8.60(VDD) U8.73(VDD) U8.80(VDD) U8.81(VDD) U8.87(VDD) U8.101(VDD) U8.102(VDD) U8.120(VDD) U8.126(VDD)
+3V3: C89.+ C90.+ C94.1 C95.1 C99.1 C100.1 C103.1 C104.1 C107.1 C108.1 C111.1 C112.1 C116.1 L6.2 R70.1 R72.1 U8.6(VDDIOL) U8.14(VDDIOL) U8.19(VDDIOL) U8.29(VDDIOL) U8.42(VDDIOL) U8.44(USB_VDD33) U8.52(VDDIOR) U8.67(VDDIOR) U8.78(VDDIOR) U8.83(VDDIOR) U8.92(VDDIOR) U8.105(OTP_VCC) U8.110(VDDIOT) U8.111(VDDIOT) U19.3(~{MR}) U19.5(VDD)
+5V5: C83.1 U17.4(VIN_SW) U17.5(VIN_A)
+12V0: C86.+ C87.+ R68.2 U18.2(IN)
GND: C81.1 C83.2 C84.2 C85.2 C86.- C87.- C89.- C90.- C91.2 C92.2 C93.2 C94.2 C95.2 C96.2 C97.2 C98.2 C99.2 C100.2 C101.2 C102.2 C103.2 C104.2 C105.2 C106.2 C107.2 C108.2 C109.2 C110.2 C111.2 C112.2 C113.2 C114.2 C115.2 C116.2 R71.2 R73.2 R74.2 R75.2 R77.2 SW1.2 SW2.2 U8.104(PLL_AGND) U8.129(GND) U17.2(GND) U17.PAD(GND) U18.4(GND) U18.9(EP) U19.2(GND)
NetC81_2: C81.2 U18.8(SS)
NetC82_1: C82.1 U18.1(BS)
NetC82_2: C82.2 L6.1 U18.3(SW)
NetC84_1: C84.1 L4.2 L5.1 R69.1
NetC88_1: C88.1 C91.1 U18.6(COMP)
NetC88_2: C88.2 R74.1
NetC92_1: C92.1 R70.2 R73.1 U17.6(EN)
NetC93_1: C93.1 R78.2 U8.103(PLL_AVDD)
NetD9_2: SW1.1 SW2.1 U19.1(~{RST}) ; port nPOR
NetL4_1: L4.1 U17.3(SW)
NetR68_1: R68.1 U18.7(EN)
NetR69_2: R69.2 R71.1 U17.1(FB)
NetR72_2: R72.2 R75.1 U18.5(FB)
NetR76_2: R76.2 R77.1 U19.4(IN)

Not connected (* = marked no-connect by the designer): SW1 3 4; SW2 3 4; U8 50(NC)* 65(NC)*

### Notes on the sheet
- Sheet Name
- Project Title
- Size
- Group
- Revision
- Date :
- Filename :
- Sheet
- Authors :
- of
- (in symbol MIC2774N-29YM5-TR) -; +; 2V9; 0V3
- (in symbol XMOS_XEF216-512-TQ128, part B) POWER

### Library data of the parts
C81 C85 C92-C116 = Capacitor: Mfg: Samsung; Mfg_PN: CL10F104ZO8NNNC; HelpURL: *; Supplier1: Digikey; Supplier1_PN: 1276-1258-1-ND; Tolerance: *; Type: *; Rating: *
  C81: NI: NI
  C85 C92-C116: NI: *
C82 = Capacitor: Mfg: Samsung; Mfg_PN: CL10B102KB8NNNC; HelpURL: https://www.digikey.ca/product-detail/en/samsung-electro-mechanics/CL10B102KB8NNNC/1276-1018-1-ND/3889104; NI: NI; Supplier1: Digikey; Supplier1_PN: 1276-1018-1-ND; Tolerance: *; Type: *; Rating: *
C83 = Capacitor: Mfg: Samsung; Mfg_PN: CL21A475KAQNNNG; HelpURL: *; NI: *; Supplier1: Digikey; Supplier1_PN: 1276-6462-1-ND; Tolerance: *; Type: *; Rating: *
C84 = Capacitor: Mfg: Samsung; Mfg_PN: CL31F226ZPHNNNE; HelpURL: *; NI: *; Supplier1: Digikey; Supplier1_PN: 1276-3296-1-ND; Tolerance: *; Type: *; Rating: *
C86 C87 C89 C90 = Capacitor_Polarized: as C8 on sheet Power; HelpURL: *; NI: *; Supplier1: Digikey; Supplier1_PN: 493-2100-1-ND; Tolerance: *; Type: *; Rating: *
C88 C91 = Capacitor: Mfg: Samsung; Mfg_PN: CL10B332JB8NNNC; HelpURL: *; NI: NI; Supplier1: Digikey; Supplier1_PN: 1276-2030-1-ND; Tolerance: *; Type: *; Rating: *
L4 = Inductor: Mfg: Murata; Mfg_PN: DFE252012F-2R2M=P2; HelpURL: *; NI: *; Rating: *; Tolerance: *; Supplier1: Digikey; Supplier1_PN: 490-13055-1-ND
L5 = Ferrite: as L3 on sheet XMOS_chip; HelpURL: *; NI: *; Supplier1: Digikey; Supplier1_PN: MH2029-101YCT-ND; Tolerance: *; Type: *
L6 = Inductor: Mfg: Bourns Inc.; HelpURL: *; Mfg_PN: SRN5040-4R7M; NI: *; Rating: *; Tolerance: *; Supplier1: Digikey; Supplier1_PN: SRN5040-4R7MCT-ND
R68 = Resistor: as R5 on sheet Power; HelpURL: https://www.digikey.ca/product-detail/en/stackpole-electronics-inc/RMCF0603FT100K/RMCF0603FT100KCT-ND/1943118; NI: *; Supplier1: Digikey; Supplier1_PN: RMCF0603FT100KCT-ND; Type: *; Rating: *; Tolerance: *
R69 = Resistor: Mfg: Yageo; Mfg_PN: RC0603JR-074K7L; HelpURL: *; NI: *; Supplier1: Digikey; Supplier1_PN: 311-4.7KGRCT-ND; Type: *; Rating: *; Tolerance: *
R70 R73 = Resistor: Mfg: Yageo; Mfg_PN: 311-10GRCT-ND; HelpURL: *; NI: *; Supplier1: Digikey; Supplier1_PN: 311-100KGRCT-ND; Type: *; Rating: *; Tolerance: *
R71 = Resistor: Mfg: Yageo; Mfg_PN: RC0603JR-0718KL; HelpURL: *; NI: *; Supplier1: Digikey; Supplier1_PN: 311-18KGRCT-ND; Type: *; Rating: *; Tolerance: *
R72 = Resistor: Mfg: Stackpole Electronics Inc; Mfg_PN: RMCF0603FT25K5; HelpURL: *; NI: *; Supplier1: Digikey; Supplier1_PN: RMCF0603FT25K5CT-ND; Type: *; Rating: *
R74 R76 R77 = Resistor: Mfg: Yageo; Mfg_PN: RC0603JR-0710KL; HelpURL: *; NI: *; Supplier1: Digikey; Supplier1_PN: 311-10KGRCT-ND; Type: *; Rating: *; Tolerance: *
R75 = Resistor: as R11 on sheet Power; HelpURL: *; NI: *; Supplier1: Digikey; Supplier1_PN: RNCP0603FTD10K0CT-ND; Type: *; Rating: *
R78 = Resistor: Mfg: Yageo; Mfg_PN: RC0603JR-074R7L; HelpURL: *; NI: *; Supplier1: Digikey; Supplier1_PN: 311-4.7GRCT-ND; Type: *; Rating: *; Tolerance: *
SW1 SW2 = Button: Mfg: Wurth; Mfg_PN: 430152050826; HelpURL: *; Rating: *; Tolerance: *; Value: *; Supplier1: Digikey; Supplier1_PN: 732-6993-1-ND
  SW1: NI: NI
  SW2: NI: *
U8 = XMOS_XEF216-512-TQ128: as U8 on sheet XMOS_chip; Supplier1: Digikey; Supplier1_PN: 880-1100-ND
U17 = ST1S06PUR: DC-DC Buck Converter, 1.5A, 1.5MHz, DFN6; Mfg: ST Microelectronics; Mfg_PN: ST1S06PUR; Supplier1: Digikey; Supplier1_PN: 497-5802-1-ND
U18 = REG_SW_AP3513EMPTR-G1: Mfg: Diodes Incorporated; CreatedBy: Emile Laplante; HelpURL: https://www.digikey.ca/product-detail/en/diodes-incorporated/AP3513EMPTR-G1/AP3513EMPTR-G1DICT-ND/4505181; Mfg Part Number: AP3513EMPTR-G1; NI: *; Power: *; Supplier: Digikey; Supplier Part Numer: AP3513EMPTR-G1DICT-ND; Temperature: *; Value: *; VerifiedBy: *; Voltage: *
U19 = MIC2774N-29YM5-TR: Voltage supervisor and power-on timer, dual; Mfg: Micrel; HelpURL: *; Mfg_PN: MIC2774N-29YM5-TR; NI: *; Rating: *; Supplier1: Digikey; Supplier1_PN: 576-1101-1-ND; Tolerance: *; Type: *; Value: *

## Sheet Clock.SchDoc
size Tabloid; DocumentNumber: 4; SheetNumber: 4; SheetTotal: 11; SheetName: Clock; ProjectTitle: 16SoundsUSB; Size: 11x17; Sheet_Name: Clock
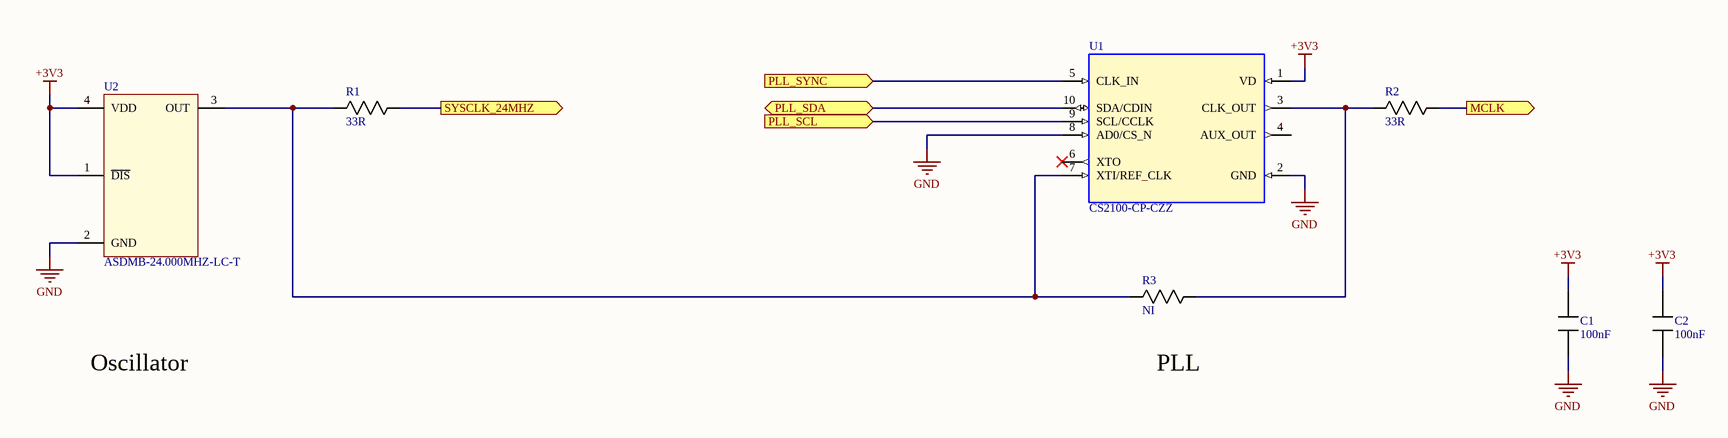
[diagram p4: Clock.SchDoc]

### Parts
C1  value 100nF  [0603]  (hidden comment: Capacitor)
C2  value 100nF  [0603]  (hidden comment: Capacitor)
R1  value 33R  [0603]  (hidden comment: Resistor)
R2  value 33R  [0603]  (hidden comment: Resistor)
R3  Resistor  [0603]  (value not drawn)
U1  Mfg_PN: CS2100-CP-CZZ  [MSOP10]  (hidden comment: CS2100_CP)
U2  Mfg_PN: ASDMB-24.000MHZ-LC-T  [OSC_ADSMB]  (hidden comment: OSC_ASDMB)

### Ports
MCLK (out), PLL_SCL (in), PLL_SDA (bidir), PLL_SYNC (in), SYSCLK_24MHZ (out)

### Nets
+3V3: C1.1 C2.1 U1.1(VD) U2.1(~{DIS}) U2.4(VDD)
GND: C1.2 C2.2 U1.2(GND) U1.8(AD0/CS_N) U2.2(GND)
I2C_SCL: U1.9(SCL/CCLK) ; port PLL_SCL
I2C_SDA: U1.10(SDA/CDIN) ; port PLL_SDA
MCLK_XCORE: R2.2 ; port MCLK
NetR1_1: R1.1 R3.1 U1.7(XTI/REF_CLK) U2.3(OUT)
NetR1_2: R1.2 ; port SYSCLK_24MHZ
NetR2_1: R2.1 R3.2 U1.3(CLK_OUT)
NetU1_5: U1.5(CLK_IN) ; port PLL_SYNC

Not connected (* = marked no-connect by the designer): U1 4(AUX_OUT) 6(XTO)*

### Notes on the sheet
- Oscillator
- PLL
- Sheet Name
- Project Title
- Size
- Group
- Revision
- Date :
- Filename :
- Sheet
- Authors :
- of

### Library data of the parts
C1 C2 = Capacitor: Mfg: Samsung; Mfg_PN: CL10F104ZO8NNNC; HelpURL: *; NI: *; Supplier1: Digikey; Supplier1_PN: 1276-1258-1-ND; Tolerance: *; Type: *; Rating: *
R1 R2 = Resistor: Mfg: Yageo; Mfg_PN: RC0603JR-0733RL; HelpURL: *; NI: *; Supplier1: Digikey; Supplier1_PN: 311-33GRCT-ND; Type: *; Rating: *; Tolerance: *
R3 = Resistor: Value: 0R; HelpURL: *; Mfg: *; Mfg_PN: *; NI: NI; Supplier1: *; Supplier1_PN: *; Type: *; Rating: *; Tolerance: *
U1 = CS2100_CP: Fractional-N Clock Multiplier, Crystal Reference, MSOP10; Mfg: Cirrus Logic; Supplier1: Digikey; Supplier1_PN: 598-1750-ND
U2 = OSC_ASDMB: Oscillator; 1V8 to 3V3; Mfg: Abracon; HelpURL: http://www.abracon.com/Oscillators/ASDMB.pdf; Supplier1: Digikey; Supplier1_PN: 535-11728-1-ND; NI: *; Type: 24MHz